# Altium project Pixracer_V1_FMU_Alternative.PrjPcb (part 1 of 2)
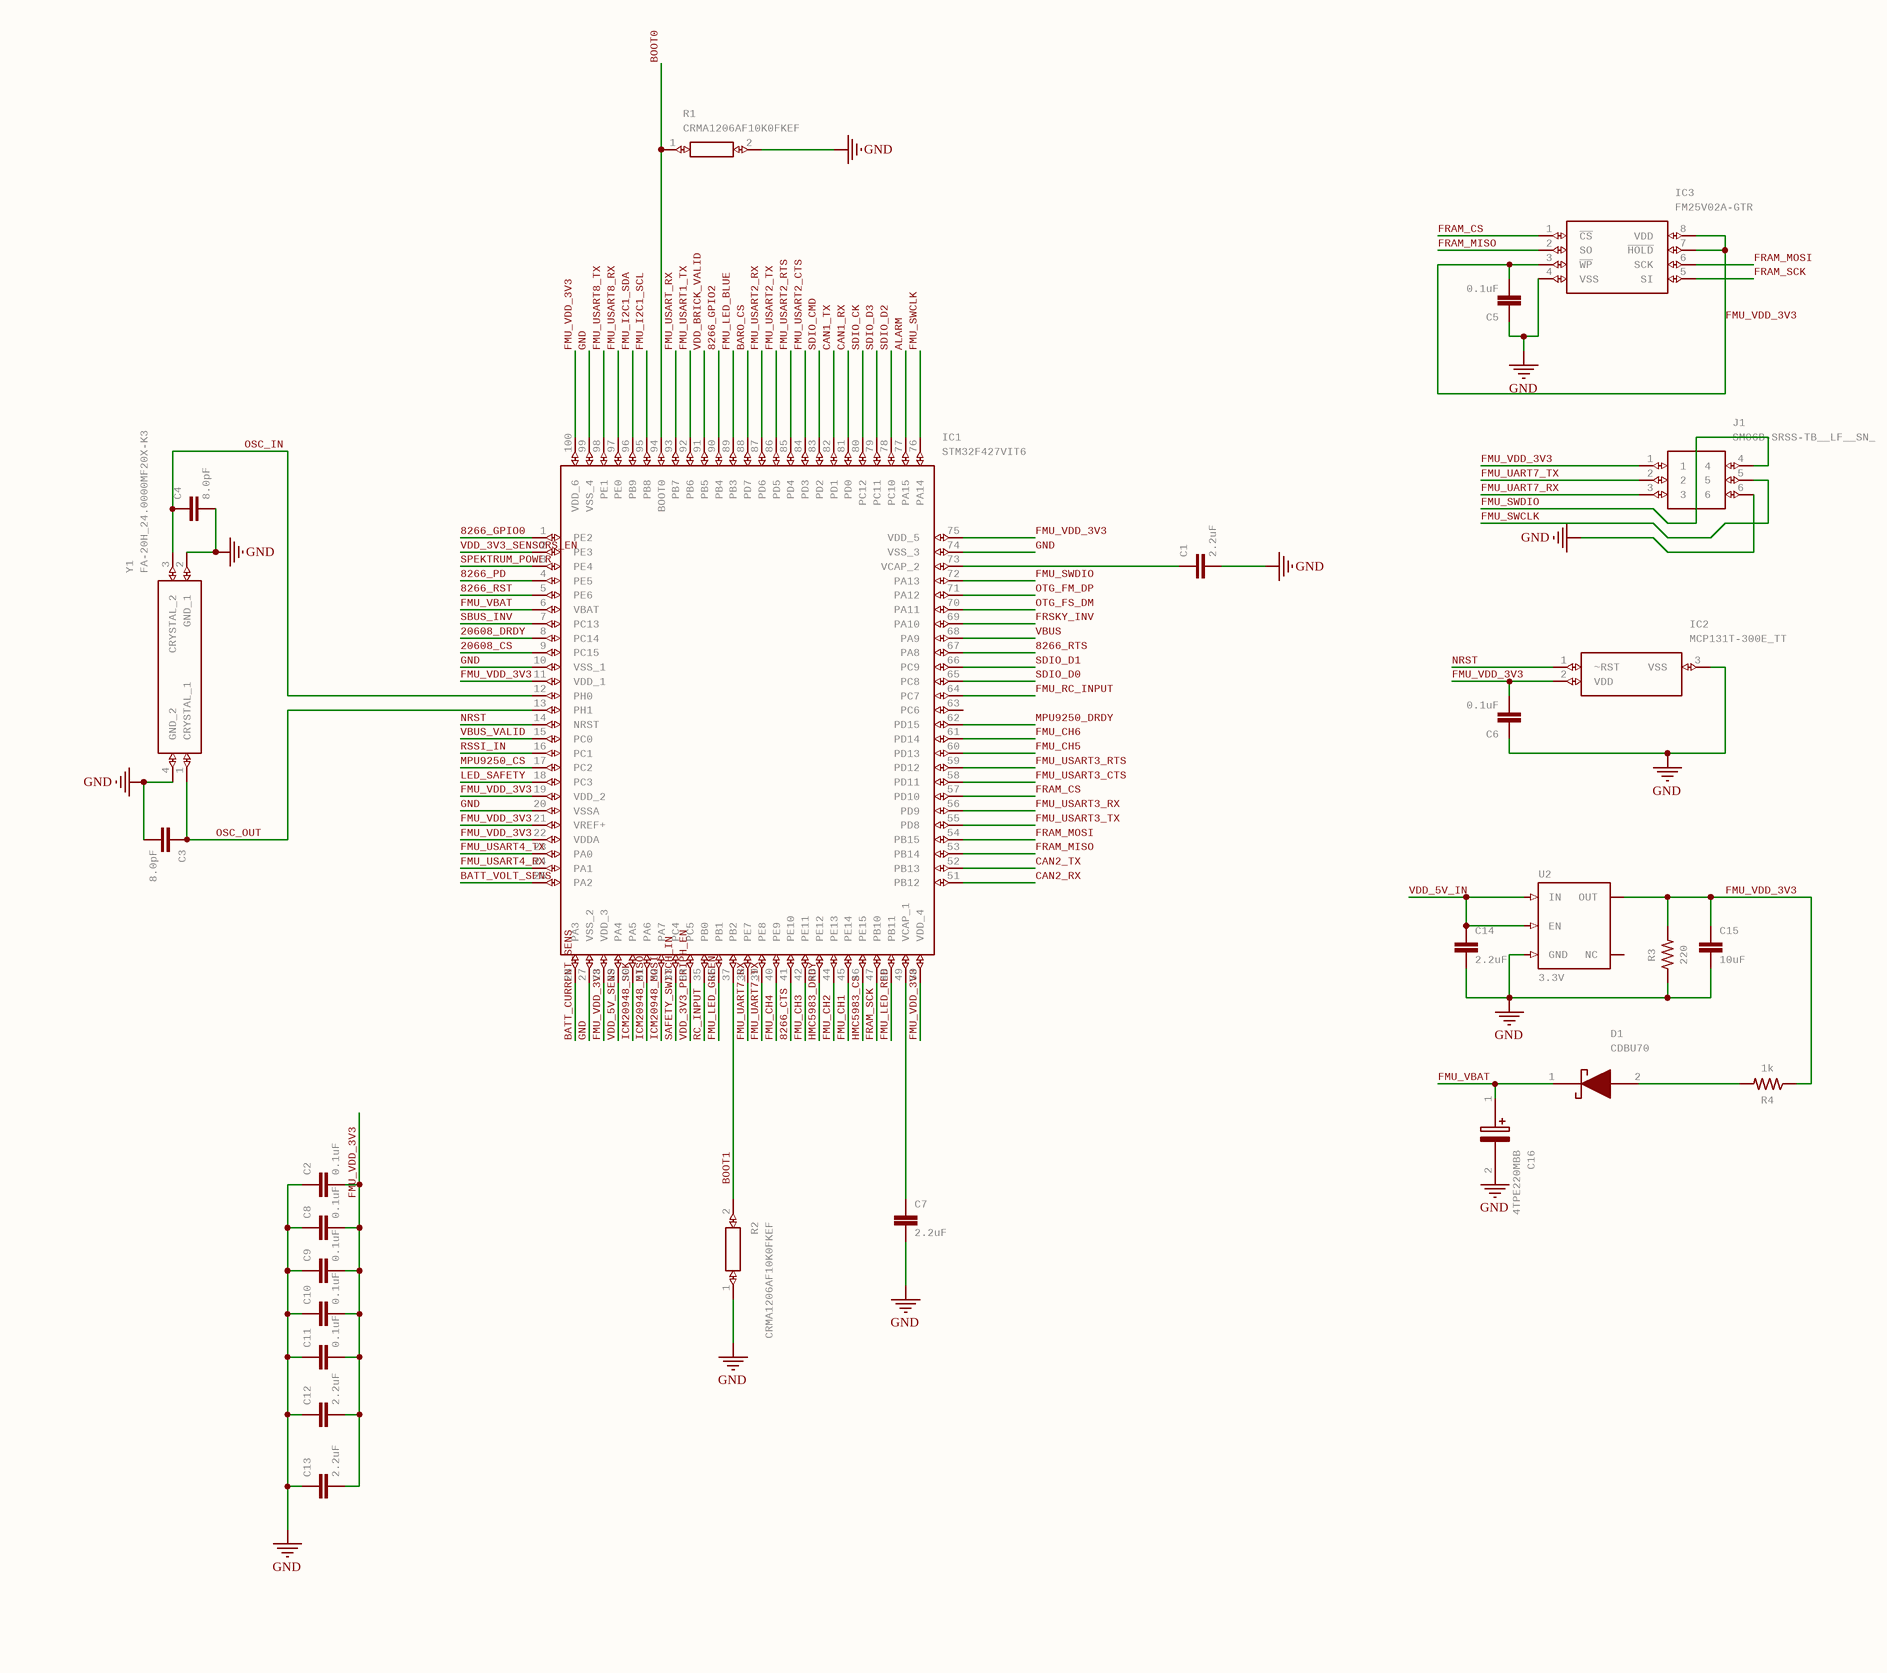
[diagram p0: Pixracer_V1_FMU_Alternative_0.SchDoc]
5 sheets, 139 parts. Net scope: global (net labels, ports and power ports of the same name join across sheets).
Board file: Pixracer_V1_FMU_Alternative.PcbDoc
Sheets:
  Pixracer_V1_FMU_Alternative_0.SchDoc
  Pixracer_V1_FMU_Alternative_1.SchDoc
  Pixracer_V1_FMU_Alternative_2.SchDoc
  Pixracer_V1_FMU_Alternative_3.SchDoc
  Pixracer_V1_FMU_Alternative_4.SchDoc

## Sheet Pixracer_V1_FMU_Alternative_0.SchDoc
size 331 x 293 mm; Origin: Eagle

### Parts
C1  2.2uF  [1206]
C2  0.1uF  [0603]
C3  8.0pF  [0603]
C4  8.0pF  [0603]
C5  0.1uF  [0402]
C6  0.1uF  [0402]
C7  2.2uF  [1206]
C8  0.1uF  [0603]
C9  0.1uF  [0603]
C10  0.1uF  [0603]
C11  0.1uF  [0603]
C12  2.2uF  [1206]
C13  2.2uF  [1206]
C14  2.2uF  [1206]
C15  10uF  [1206]
C16  4TPE220MBB  [4TPE220MBB]
D1  CDBU70  [DIOM179X85N]
IC1  STM32F427VIT6  [QFP50P1600X1600X160-100N]
IC2  MCP131T-300E_TT  [SOT95P237X112-3N]
IC3  FM25V02A-GTR  [SOIC127P602X173-8N]
J1  SM06B-SRSS-TB__LF__SN_  [SM06B-SRSS-TB]
R1  CRMA1206AF10K0FKEF  [RESC3216X74N]
R2  CRMA1206AF10K0FKEF  [RESC3216X74N]
R3  220  [0603]
R4  1k  [0603]
U2  3.3V  [SOT23-5]
Y1  FA-20H_24.0000MF20X-K3  [FA20H160000MF12ZAC3]

### Nets
GND: C1.2 C2.1 C3.2 C4.2 C5.1 C6.1 C7.2 C8.1 C9.1 C10.1 C11.1 C12.1 C13.1 C14.2 C15.2 C16.2(-) IC1.10(VSS_1) IC1.20(VSSA) IC1.27(VSS_2) IC1.74(VSS_3) IC1.99(VSS_4) IC2.3(VSS) IC3.4(VSS) J1.6 R1.2 R2.1 R3.1 U2.2(GND) Y1.2(GND_1) Y1.4(GND_2)
8266_CTS: IC1.41(PE10)
8266_GPIO0: IC1.1(PE2)
8266_GPIO2: IC1.90(PB4)
8266_PD: IC1.4(PE5)
8266_RST: IC1.5(PE6)
8266_RTS: IC1.67(PA8)
20608_CS: IC1.9(PC15)
20608_DRDY: IC1.8(PC14)
ALARM: IC1.77(PA15)
BARO_CS: IC1.88(PD7)
BATT_CURRENT_SENS: IC1.26(PA3)
BATT_VOLT_SENS: IC1.25(PA2)
BOOT0: IC1.94(BOOT0) R1.1
BOOT1: IC1.37(PB2) R2.2
CAN1_RX: IC1.81(PD0)
CAN1_TX: IC1.82(PD1)
CAN2_RX: IC1.51(PB12)
CAN2_TX: IC1.52(PB13)
FMU_CH1: IC1.45(PE14)
FMU_CH2: IC1.44(PE13)
FMU_CH3: IC1.42(PE11)
FMU_CH4: IC1.40(PE9)
FMU_CH5: IC1.60(PD13)
FMU_CH6: IC1.61(PD14)
FMU_I2C1_SCL: IC1.95(PB8)
FMU_I2C1_SDA: IC1.96(PB9)
FMU_LED_BLUE: IC1.89(PB3)
FMU_LED_GREEN: IC1.36(PB1)
FMU_LED_RED: IC1.48(PB11)
FMU_RC_INPUT: IC1.64(PC7)
FMU_SWCLK: IC1.76(PA14) J1.5
FMU_SWDIO: IC1.72(PA13) J1.4
FMU_UART7_RX: IC1.38(PE7) J1.3
FMU_UART7_TX: IC1.39(PE8) J1.2
FMU_USART1_TX: IC1.92(PB6)
FMU_USART2_CTS: IC1.84(PD3)
FMU_USART2_RTS: IC1.85(PD4)
FMU_USART2_RX: IC1.87(PD6)
FMU_USART2_TX: IC1.86(PD5)
FMU_USART3_CTS: IC1.58(PD11)
FMU_USART3_RTS: IC1.59(PD12)
FMU_USART3_RX: IC1.56(PD9)
FMU_USART3_TX: IC1.55(PD8)
FMU_USART4_RX: IC1.24(PA1)
FMU_USART4_TX: IC1.23(PA0)
FMU_USART8_RX: IC1.97(PE0)
FMU_USART8_TX: IC1.98(PE1)
FMU_USART_RX: IC1.93(PB7)
FMU_VBAT: C16.1(+) D1.1(K) IC1.6(VBAT)
FMU_VDD_3V3: C2.2 C5.2 C6.2 C8.2 C9.2 C10.2 C11.2 C12.2 C13.2 C15.1 IC1.11(VDD_1) IC1.19(VDD_2) IC1.21(VREF+) IC1.22(VDDA) IC1.28(VDD_3) IC1.50(VDD_4) IC1.75(VDD_5) IC1.100(VDD_6) IC2.2(VDD) IC3.3(~{WP}) IC3.7(~{HOLD}) IC3.8(VDD) J1.1 R3.2 R4.1 U2.5(OUT)
FRAM_CS: IC1.57(PD10) IC3.1(~{CS})
FRAM_MISO: IC1.53(PB14) IC3.2(SO)
FRAM_MOSI: IC1.54(PB15) IC3.6(SCK)
FRAM_SCK: IC1.47(PB10) IC3.5(SI)
FRSKY_INV: IC1.69(PA10)
HMC5983_CS: IC1.46(PE15)
HMC5983_DRDY: IC1.43(PE12)
ICM20948_MISO: IC1.31(PA6)
ICM20948_MOSI: IC1.32(PA7)
ICM20948_SCK: IC1.30(PA5)
LED_SAFETY: IC1.18(PC3)
MPU9250_CS: IC1.17(PC2)
MPU9250_DRDY: IC1.62(PD15)
NRST: IC1.14(NRST) IC2.1(~RST)
OSC_IN: C4.1 IC1.12(PH0) Y1.3(CRYSTAL_2)
OSC_OUT: C3.1 IC1.13(PH1) Y1.1(CRYSTAL_1)
OTG_FM_DP: IC1.71(PA12)
OTG_FS_DM: IC1.70(PA11)
RC_INPUT: IC1.35(PB0)
RSSI_IN: IC1.16(PC1)
SAFETY_SWITCH_IN: IC1.33(PC4)
SBUS_INV: IC1.7(PC13)
SDIO_CK: IC1.80(PC12)
SDIO_CMD: IC1.83(PD2)
SDIO_D0: IC1.65(PC8)
SDIO_D1: IC1.66(PC9)
SDIO_D2: IC1.78(PC10)
SDIO_D3: IC1.79(PC11)
SPEKTRUM_POWER: IC1.3(PE4)
VBUS: IC1.68(PA9)
VBUS_VALID: IC1.15(PC0)
VDD_3V3_PERIPH_EN: IC1.34(PC5)
VDD_3V3_SENSORS_EN: IC1.2(PE3)
VDD_5V_IN: C14.1 U2.1(IN) U2.3(EN)
VDD_5V_SENS: IC1.29(PA4)
VDD_BRICK_VALID: IC1.91(PB5)
NetC1_1: C1.1 IC1.73(VCAP_2)
NetC7_1: C7.1 IC1.49(VCAP_1)
NetD1_2: D1.2(A) R4.2

Not connected (* = marked no-connect by the designer): IC1 63(PC6); U2 4(NC)

### Library data of the parts
C1 C7 C12-C14 = 2.2UF-1206-50V-10%: 2.2ÂµF ceramic capacitors    A capacitor is a passive two-terminal electrical component used to store electrical energy temporarily in an electric field.; GateName_1: G$1; SymbolName_1: CAP; PROD_ID: CAP-10009; DeviceName: -1206-50V-10%; LibraryName: SparkFun-Capacitors; DeviceSetName: 2.2UF
C2 C8-C11 = 0.1UF-0603-100V-10%-X7R-WE: 0.1ÂµF ceramic capacitors    A capacitor is a passive two-terminal electrical component used to store electrical energy temporarily in an electric field.; GateName_1: G$1; SymbolName_1: CAP; PROD_ID: CAP-16436; DeviceName: -0603-100V-10%-X7R-WE; LibraryName: SparkFun-Capacitors; DeviceSetName: 0.1UF
C3 C4 = 9.0PF-0603-50V-10%: 9.0pF ceramic capacitors    A capacitor is a passive two-terminal electrical component used to store electrical energy temporarily in an electric field.; GateName_1: G$1; SymbolName_1: CAP; PROD_ID: CAP-09341; DeviceName: -0603-50V-10%; LibraryName: SparkFun-Capacitors; DeviceSetName: 9.0PF
C5 C6 = 0.1UF-0402-6.3V-10%-X7R: 0.1ÂµF ceramic capacitors    A capacitor is a passive two-terminal electrical component used to store electrical energy temporarily in an electric field.; GateName_1: G$1; SymbolName_1: CAP; PROD_ID: CAP-14993; DeviceName: -0402-6.3V-10%-X7R; LibraryName: SparkFun-Capacitors; DeviceSetName: 0.1UF
C15 = 10UF-1206-6.3V-20%: 10.0ÂµF ceramic capacitors    A capacitor is a passive two-terminal electrical component used to store electrical energy temporarily in an electric field.; GateName_1: G$1; SymbolName_1: CAP; PROD_ID: CAP-10057; DeviceName: -1206-6.3V-20%; LibraryName: SparkFun-Capacitors; DeviceSetName: 10UF
C16 = 4TPE220MBB: Tantalum Capacitors - Polymer 4VDC 220uF 20% ESR 70mOhm   Source:  Datasheet; MANUFACTURER_NAME: Panasonic; GateName_1: G$1; SymbolName_1: 4TPE220MBB; LibraryName: SamacSys_Parts; DeviceSetName: 4TPE220MBB; HEIGHT: 2mm; MANUFACTURER_PART_NUMBER: 4TPE220MBB; MOUSER_PART_NUMBER: 667-4TPE220MBB; MOUSER_PRICE-STOCK: https://www.mouser.co.uk/ProductDetail/Panasonic/4TPE220MBB?qs=4qgZ1GHix0V27BnmRtQYow%3D%3D
D1 = CDBU70: Schottky Diodes & Rectifiers Schottky Barr Diode 70mA, 70V   Source:  Datasheet; MANUFACTURER_NAME: Comchip Technology; GateName_1: G$1; SymbolName_1: CDBU70; LibraryName: SamacSys_Parts; DeviceSetName: CDBU70; HEIGHT: 0.85mm; MANUFACTURER_PART_NUMBER: CDBU70; MOUSER_PART_NUMBER: 750-CDBU70; MOUSER_PRICE-STOCK: https://www.mouser.co.uk/ProductDetail/Comchip-Technology/CDBU70?qs=J1R1puj4KiHu6WmHr9F3%252Bw%3D%3D
IC1 = STM32F427VIT6: NewSTM32F427VIT6 32bit ARM Cortex M4 MCU, 180MHz, 2048 kB Flash, 256 (System) kB, 4 (Backup) kB RAM, 100-pin LQFP   Source:  Datasheet; MANUFACTURER_NAME: STMicroelectronics; GateName_1: G$1; SymbolName_1: STM32F427VIT6; LibraryName: SamacSys_Parts; DeviceSetName: STM32F427VIT6; HEIGHT: 1.6mm; MANUFACTURER_PART_NUMBER: STM32F427VIT6; MOUSER_PART_NUMBER: 511-STM32F427VIT6; MOUSER_PRICE-STOCK: https://www.mouser.co.uk/ProductDetail/STMicroelectronics/STM32F427VIT6?qs=GlLcxsc1hfFxlQzXIfPRUw%3D%3D
IC2 = MCP131T-300E_TT: Microchip MCP131T-300E/TT, Voltage Supervisor 2.857  3.003 V, 3-Pin SOT-23B   Source:  Datasheet; GateName_1: G$1; SymbolName_1: MCP131T-300E_TT; LibraryName: SamacSys_Parts; DeviceSetName: MCP131T-300E_TT; HEIGHT: mm; MANUFACTURER_NAME: Microchip; MANUFACTURER_PART_NUMBER: MCP131T-300E/TT; MOUSER_PART_NUMBER: 579-MCP131T-300E/TT; MOUSER_PRICE-STOCK: https://www.mouser.com/Search/Refine.aspx?Keyword=579-MCP131T-300E%2FTT
IC3 = FM25V02A-GTR: CYPRESS SEMICONDUCTOR - FM25V02A-GTR - NON-VOL MEMORY, 256KBIT, 40MHZ, SOIC-8   Source:  Datasheet; GateName_1: G$1; SymbolName_1: FM25V02A-GTR; LibraryName: SamacSys_Parts; DeviceSetName: FM25V02A-GTR; HEIGHT: 1.727mm; MANUFACTURER_NAME: Cypress Semiconductor; MANUFACTURER_PART_NUMBER: FM25V02A-GTR; MOUSER_PART_NUMBER: 727-FM25V02A-GTR; MOUSER_PRICE-STOCK: https://www.mouser.co.uk/ProductDetail/Cypress-Semiconductor/FM25V02A-GTR?qs=ILgNtqsyH21Sja70fv%2FiBQ%3D%3D
J1 = SM06B-SRSS-TB__LF__SN_: connector,multipole PCB use,SM06B-SRSS-T JST SH Series, 1mm Pitch 6 Way 1 Row Right Angle PCB Header, Solder Termination, 1A   Source:  Datasheet; MANUFACTURER_NAME: JST (JAPAN SOLDERLESS TERMINALS); MANUFACTURER_PART_NUMBER: SM06B-SRSS-TB (LF)(SN); GateName_1: G$1; SymbolName_1: SM06B-SRSS-TB__LF__SN_; LibraryName: SamacSys_Parts; DeviceSetName: SM06B-SRSS-TB__LF__SN_; HEIGHT: mm; RS_PART_NUMBER: 5468827; RS_PRICE-STOCK: http://uk.rs-online.com/web/p/products/5468827
R1 R2 = CRMA1206AF10K0FKEF: Thick Film Resistors - SMD 0.30W 10Kohm 1% AEC-Q200   Source:  Datasheet; MANUFACTURER_NAME: Vishay; GateName_1: G$1; SymbolName_1: CRMA1206AF10K0FKEF; LibraryName: SamacSys_Parts; DeviceSetName: CRMA1206AF10K0FKEF; HEIGHT: 0.74mm; MANUFACTURER_PART_NUMBER: CRMA1206AF10K0FKEF; MOUSER_PART_NUMBER: 71-CRMA1206AF10K0FKF; MOUSER_PRICE-STOCK: https://www.mouser.co.uk/ProductDetail/Vishay/CRMA1206AF10K0FKEF?qs=TiOZkKH1s2Q81nOs5FD1Wg%3D%3D
R3 = 220OHM-0603-1/10W-1%: 220Î© resistor    A resistor is a passive two-terminal electrical component that implements electrical resistance as a circuit element. Resistors act to reduce current flow, and, at the same time, act to lower voltage levels within circuits. - Wikipedia; GateName_1: G$1; DeviceSetName: 220OHM; PROD_ID: RES-07861; SymbolName_1: RESISTOR; DeviceName: -0603-1/10W-1%; LibraryName: SparkFun-Resistors
R4 = 1KOHM-0603-1/10W-1%: 1kÎ© resistor    A resistor is a passive two-terminal electrical component that implements electrical resistance as a circuit element. Resistors act to reduce current flow, and, at the same time, act to lower voltage levels within circuits. - Wikipedia; GateName_1: G$1; DeviceSetName: 1KOHM; PROD_ID: RES-07856; SymbolName_1: RESISTOR; DeviceName: -0603-1/10W-1%; LibraryName: SparkFun-Resistors
U2 = V_REG_LP5907SOT23-3.0V: LP5907 - 250mA Ultra-Low-Noise LDO Regulator w/ Enable    The LP5907 is a low-noise LDO that can supply up to 250 mA output current. Designed to meet the requirements of RF and analog circuits, the LP5907 device provides low noise, high PSRR, low quiescent current, and low line or load transient response figures. Using new innovative design techniques, the LP5907 offers class-leading noise performance without a noise bypass capacitor and the ability for remote output capacitor placement. The device is designed to work with a 1-ÂµF input and a 1-ÂµF output ceramic capacitor (no separate noise bypass capacitor is required). This device is available with fixed output voltages from 1.2 V to 4.5 V in 25-mV steps.; MANU_PART: LP5907MFX-3.0/NOPB; GateName_1: G$1; SymbolName_1: V-REG-LDO_NO-BP; PROD_ID: VREG-15586; DeviceName: SOT23-3.0V; LibraryName: SparkFun-IC-Power; DeviceSetName: V_REG_LP5907; DIGIKEY_PART: 296-40357-1-ND; MOUSER_PART: 595-LP5907MFX-3.0NPB; PACKAGE: SOT-23(5)
Y1 = FA-20H_24.0000MF20X-K3: Source:  Datasheet; MANUFACTURER_NAME: Epson Timing; MANUFACTURER_PART_NUMBER: FA-20H 24.0000MF20X-K3; GateName_1: G$1; SymbolName_1: FA-20H_24.0000MF20X-K3; LibraryName: SamacSys_Parts; DeviceSetName: FA-20H_24.0000MF20X-K3; HEIGHT: 0.55mm; MOUSER_PART_NUMBER: 732-FA20H-24F20X-K3; MOUSER_PRICE-STOCK: https://www.mouser.co.uk/ProductDetail/Epson-Timing/FA-20H-240000MF20X-K3?qs=CANAagUtPAp2w31393daZQ%3D%3D

## Sheet Pixracer_V1_FMU_Alternative_1.SchDoc
size 431 x 179 mm; Origin: Eagle
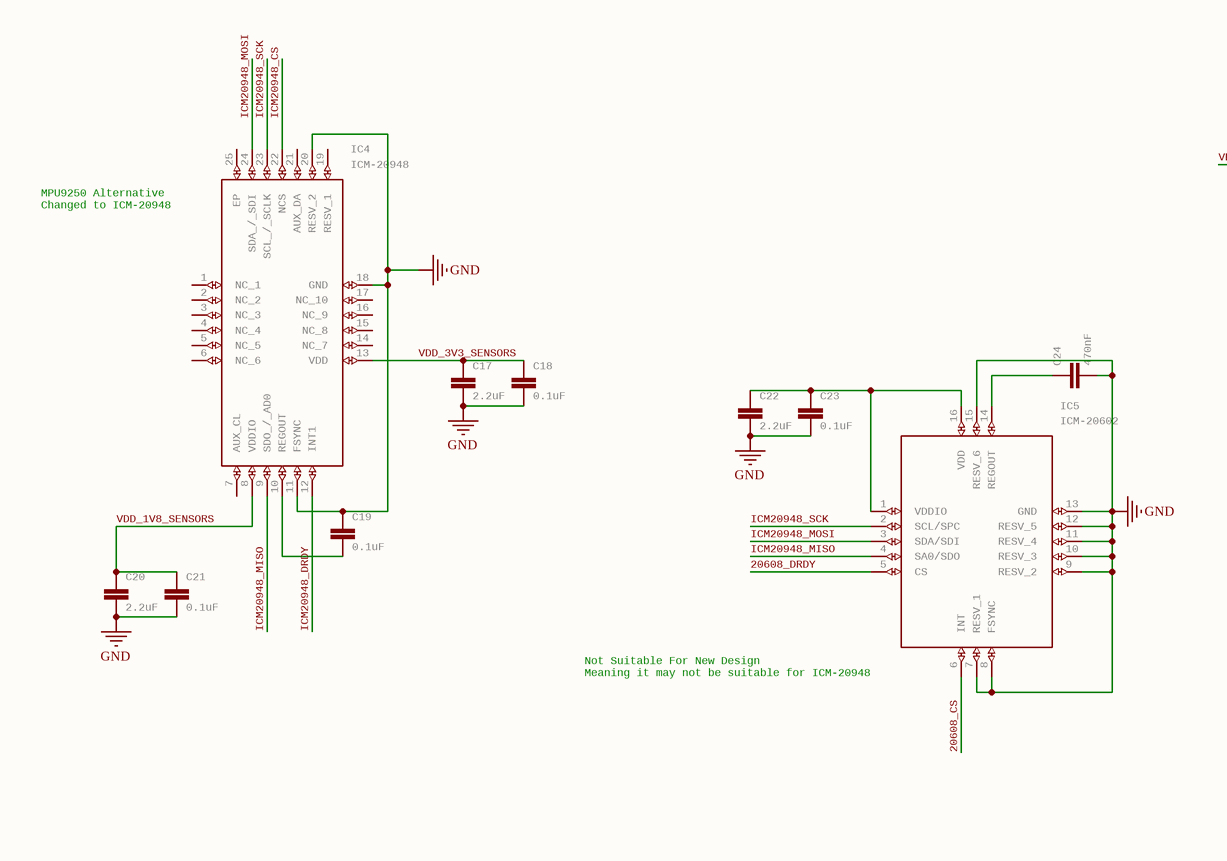
[diagram p1: Pixracer_V1_FMU_Alternative_1.SchDoc, left]
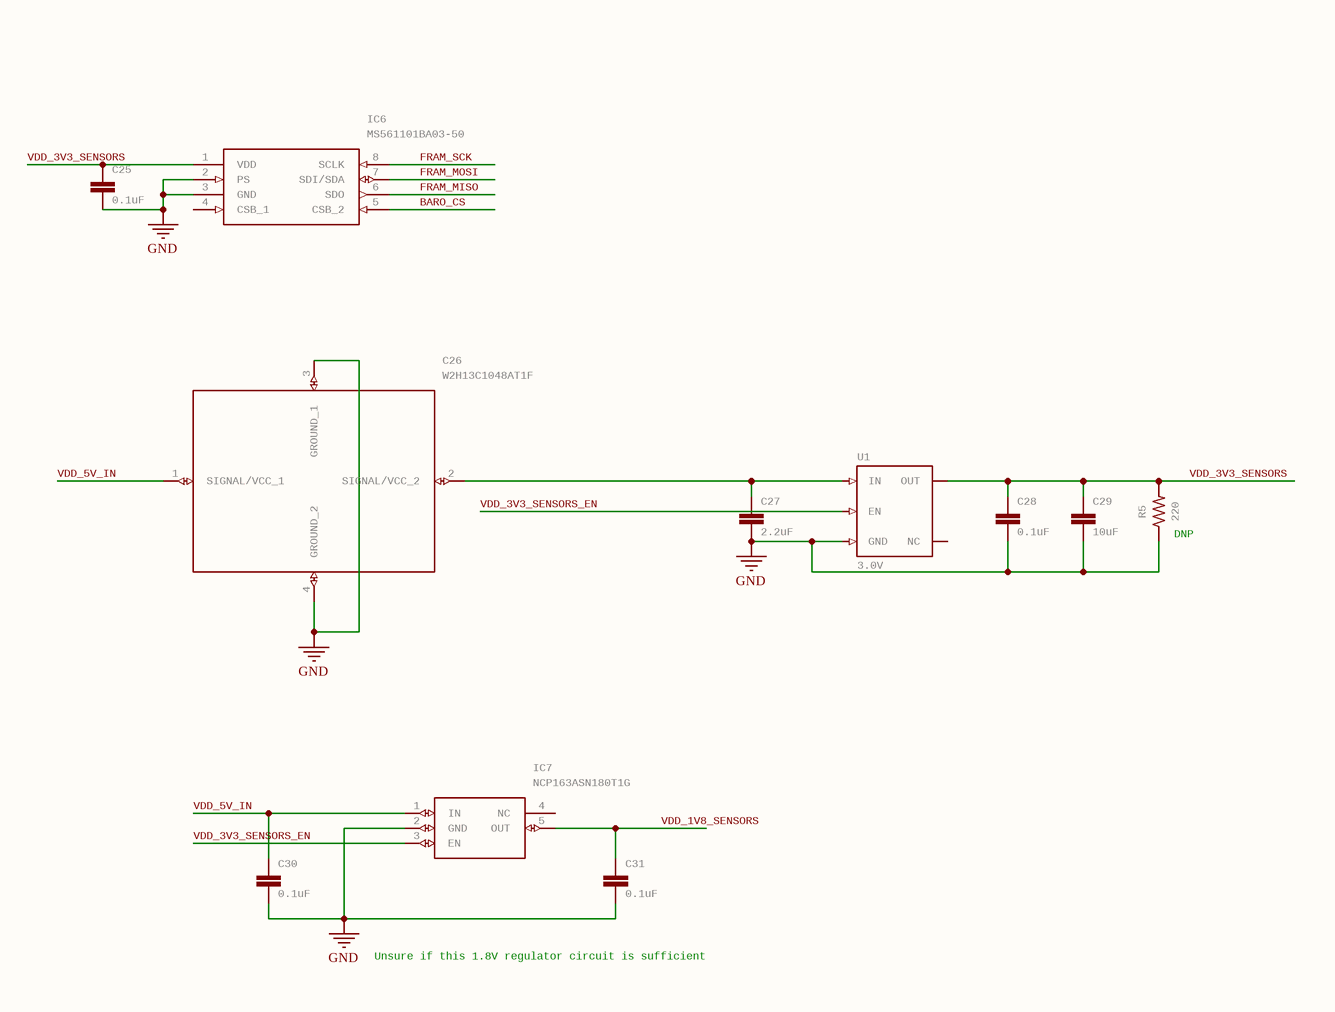
[diagram p2: Pixracer_V1_FMU_Alternative_1.SchDoc, right]

### Parts
C17  2.2uF  [1206]
C18  0.1uF  [0603]
C19  0.1uF  [0603]
C20  2.2uF  [1206]
C21  0.1uF  [0603]
C22  2.2uF  [1206]
C23  0.1uF  [0603]
C24  470nF  [0603]
C25  0.1uF  [0603]
C26  W2H13C1048AT1F  [W2H13C1048AT1A]
C27  2.2uF  [1206]
C28  0.1uF  [0603]
C29  10uF  [1206]
C30  0.1uF  [0603]
C31  0.1uF  [0603]
IC4  ICM-20948  [QFN40P300X300X105-25N]
IC5  ICM-20602  [IAM20680HP]
IC6  MS561101BA03-50  [MS561101BA03-50]
IC7  NCP163ASN180T1G  [SOT95P280X145-5N]
R5  220  [0603]
U1  3.0V  [SOT23-5]

### Nets
GND: C17.2 C18.2 C19.1 C20.2 C21.2 C22.2 C23.2 C24.2 C25.2 C26.3(GROUND_1) C26.4(GROUND_2) C27.2 C28.2 C29.2 C30.2 C31.2 IC4.11(FSYNC) IC4.18(GND) IC4.20(RESV_2) IC5.7(RESV_1) IC5.8(FSYNC) IC5.9(RESV_2) IC5.10(RESV_3) IC5.11(RESV_4) IC5.12(RESV_5) IC5.13(GND) IC5.15(RESV_6) IC6.2(PS) IC6.3(GND) IC7.2(GND) R5.1 U1.2(GND)
20608_CS: IC5.6(INT)
20608_DRDY: IC5.5(CS)
BARO_CS: IC6.5(CSB_2)
FRAM_MISO: IC6.6(SDO)
FRAM_MOSI: IC6.7(SDI/SDA)
FRAM_SCK: IC6.8(SCLK)
ICM20948_CS: IC4.22(NCS)
ICM20948_DRDY: IC4.12(INT1)
ICM20948_MISO: IC4.9(SDO_/_AD0) IC5.4(SA0/SDO)
ICM20948_MOSI: IC4.24(SDA_/_SDI) IC5.3(SDA/SDI)
ICM20948_SCK: IC4.23(SCL_/_SCLK) IC5.2(SCL/SPC)
VDD_1V8_SENSORS: C20.1 C21.1 C31.1 IC4.8(VDDIO) IC7.5(OUT)
VDD_3V3_SENSORS: C17.1 C18.1 C25.1 C28.1 C29.1 IC4.13(VDD) IC6.1(VDD) R5.2 U1.5(OUT)
VDD_3V3_SENSORS_EN: IC7.3(EN) U1.3(EN)
VDD_5V_IN: C26.1(SIGNAL/VCC_1) C30.1 IC7.1(IN)
NetC19_2: C19.2 IC4.10(REGOUT)
NetC22_1: C22.1 C23.1 IC5.1(VDDIO) IC5.16(VDD)
NetC24_1: C24.1 IC5.14(REGOUT)
NetC26_2: C26.2(SIGNAL/VCC_2) C27.1 U1.1(IN)

Not connected (* = marked no-connect by the designer): IC4 1(NC_1) 2(NC_2) 3(NC_3) 4(NC_4) 5(NC_5) 6(NC_6) 7(AUX_CL) 14(NC_7) 15(NC_8) 16(NC_9) 17(NC_10) 19(RESV_1) 21(AUX_DA) 25(EP); IC6 4(CSB_1); IC7 4(NC); U1 4(NC)

### Notes on the sheet
- (near IC4) MPU9250 Alternative
  Changed to ICM-20948
- (near R5) DNP
- (near IC5) Not Suitable For New Design
  Meaning it may not be suitable for ICM-20948
- Unsure if this 1.8V regulator circuit is sufficient

### Library data of the parts
C17 C20 C22 C27 = 2.2UF-1206-50V-10%: as C1 on sheet Pixracer_V1_FMU_Alternative_0; DeviceName: -1206-50V-10%; LibraryName: SparkFun-Capacitors; DeviceSetName: 2.2UF
C18 C19 C21 C23 C25 C28 C30 C31 = 0.1UF-0603-100V-10%-X7R-WE: as C2 on sheet Pixracer_V1_FMU_Alternative_0; DeviceName: -0603-100V-10%-X7R-WE; LibraryName: SparkFun-Capacitors; DeviceSetName: 0.1UF
C24 = 470NF-0603-10V-10%-X5R: 0.47uF/470nF ceramic capacitors    A capacitor is a passive two-terminal electrical component used to store electrical energy temporarily in an electric field.; GateName_1: G$1; SymbolName_1: CAP; PROD_ID: CAP-13216; DeviceName: -0603-10V-10%-X5R; LibraryName: SparkFun-Capacitors; DeviceSetName: 470NF
C26 = W2H13C1048AT1F: Feed Through Capacitors 25volt 0.1uF X7R   Source:  Datasheet; MANUFACTURER_NAME: AVX; GateName_1: G$1; SymbolName_1: W2H13C1048AT1F; LibraryName: SamacSys_Parts; DeviceSetName: W2H13C1048AT1F; DESCRIPTION: Feed Through Capacitors 25volt 0.1uF X7R; HEIGHT: 1mm; MANUFACTURER_PART_NUMBER: W2H13C1048AT1F; MOUSER_PART_NUMBER: 581-W2H13C1048AT1F; MOUSER_PRICE-STOCK: https://www.mouser.com/Search/Refine.aspx?Keyword=581-W2H13C1048AT1F
C29 = 10UF-1206-6.3V-20%: as C15 on sheet Pixracer_V1_FMU_Alternative_0; DeviceName: -1206-6.3V-20%; LibraryName: SparkFun-Capacitors; DeviceSetName: 10UF
IC4 = ICM-20948: IMUs - Inertial Measurement Units World's Lowest Power 9-Axis MEMS MotionTracking Device   Source:  Datasheet; MANUFACTURER_NAME: TDK; GateName_1: G$1; SymbolName_1: ICM-20948; LibraryName: SamacSys_Parts; DeviceSetName: ICM-20948; DESCRIPTION: IMUs - Inertial Measurement Units World's Lowest Power 9-Axis MEMS MotionTracking Device; HEIGHT: 1.05mm; MANUFACTURER_PART_NUMBER: ICM-20948; MOUSER_PART_NUMBER: 410-ICM-20948; MOUSER_PRICE-STOCK: https://www.mouser.co.uk/ProductDetail/TDK-InvenSense/ICM-20948?qs=u4fy%2FsgLU9OtGc31yF%2Friw%3D%3D
IC5 = ICM-20602: IMUs - Inertial Measurement Units Low-Power, High-Performance Integrated 6-Axis MEMS MotionTracking  Device in 3mm x 3mm Package   Source:  Datasheet; MANUFACTURER_NAME: TDK; GateName_1: G$1; SymbolName_1: ICM-20602; LibraryName: SamacSys_Parts; DeviceSetName: ICM-20602; DESCRIPTION: IMUs - Inertial Measurement Units Low-Power, High-Performance Integrated 6-Axis MEMS MotionTracking  Device in 3mm x 3mm Package; HEIGHT: mm; MANUFACTURER_PART_NUMBER: ICM-20602; MOUSER_PART_NUMBER: 410-ICM-20602; MOUSER_PRICE-STOCK: https://www.mouser.co.uk/ProductDetail/TDK-InvenSense/ICM-20602?qs=u4fy%2FsgLU9NtDChFbqTxBA%3D%3D
IC6 = MS561101BA03-50: Sensor Pressure 1.2bar Barometric SMD MS561101BA03-50, Barometric Pressure Sensor, 1200mbar 0  3.6 V Output, 8-Pin QFN   Source:  Datasheet; MANUFACTURER_NAME: TE Connectivity; GateName_1: G$1; SymbolName_1: MS561101BA03-50; LibraryName: SamacSys_Parts; DeviceSetName: MS561101BA03-50; DESCRIPTION: Sensor Pressure 1.2bar Barometric SMD MS561101BA03-50, Barometric Pressure Sensor, 1200mbar 0  3.6 V Output, 8-Pin QFN; HEIGHT: mm; MANUFACTURER_PART_NUMBER: MS561101BA03-50; MOUSER_PART_NUMBER: 824-MS561101BA03-50; MOUSER_PRICE-STOCK: https://www.mouser.co.uk/ProductDetail/Measurement-Specialties/MS561101BA03-50?qs=%252BgKeJhng5iV%252BnCz6Qd5iDw%3D%3D
IC7 = NCP163ASN180T1G: LDO Voltage Regulators LDO Reg, Ultra-Low Noise High PSRR 1.8V   Source:  Datasheet; MANUFACTURER_NAME: onsemi; GateName_1: G$1; SymbolName_1: NCP163ASN180T1G; LibraryName: SamacSys_Parts; DeviceSetName: NCP163ASN180T1G; DESCRIPTION: LDO Voltage Regulators LDO Reg, Ultra-Low Noise High PSRR 1.8V; HEIGHT: 1.45mm; MANUFACTURER_PART_NUMBER: NCP163ASN180T1G; MOUSER_PART_NUMBER: 863-NCP163ASN180T1G; MOUSER_PRICE-STOCK: https://www.mouser.co.uk/ProductDetail/onsemi/NCP163ASN180T1G?qs=vLWxofP3U2z0o2tJM%252BNAYw%3D%3D
R5 = 220OHM-0603-1/10W-1%: as R3 on sheet Pixracer_V1_FMU_Alternative_0; SymbolName_1: RESISTOR; DeviceName: -0603-1/10W-1%; LibraryName: SparkFun-Resistors
U1 = V_REG_LP5907SOT23-3.0V: as U2 on sheet Pixracer_V1_FMU_Alternative_0; DeviceName: SOT23-3.0V; LibraryName: SparkFun-IC-Power; DeviceSetName: V_REG_LP5907; DIGIKEY_PART: 296-40357-1-ND; MOUSER_PART: 595-LP5907MFX-3.0NPB; PACKAGE: SOT-23(5)

## Sheet Pixracer_V1_FMU_Alternative_2.SchDoc
size 287 x 183 mm; Origin: Eagle
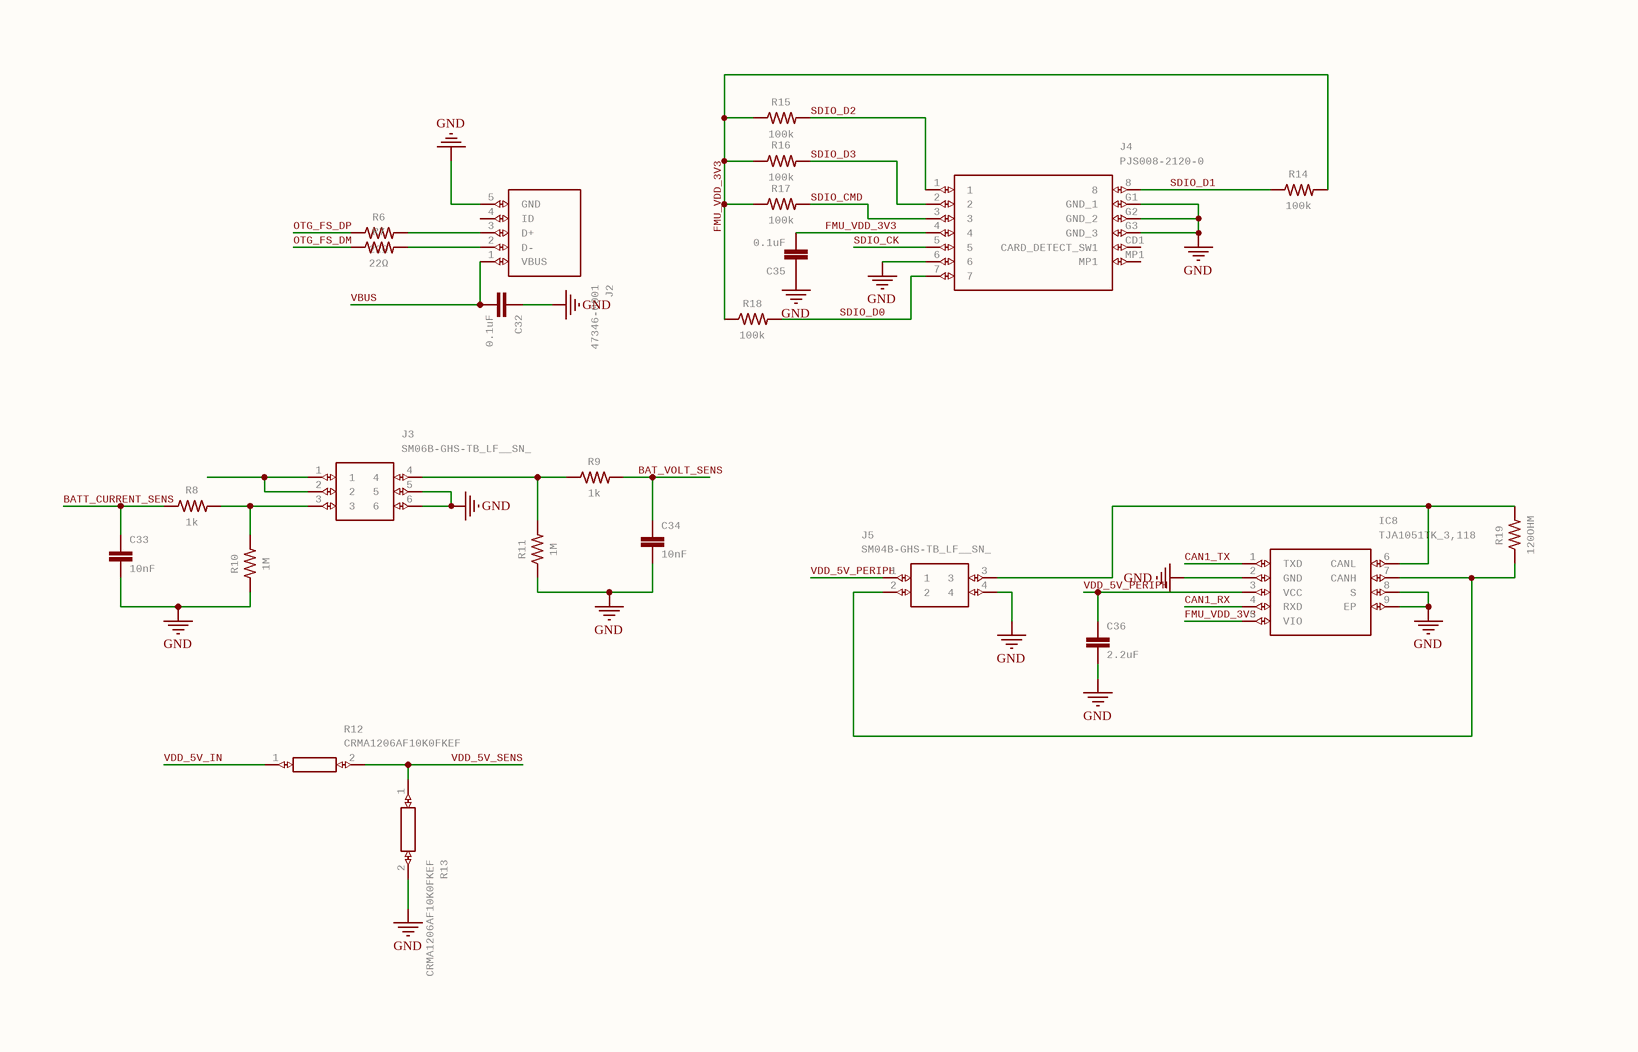
[diagram p3: Pixracer_V1_FMU_Alternative_2.SchDoc]

### Parts
C32  0.1uF  [0603]
C33  10nF  [0603]
C34  10nF  [0603]
C35  0.1uF  [0603]
C36  2.2uF  [1206]
IC8  TJA1051TK_3,118  [SON65P300X300X100-9N]
J2  47346-0001  [47346-0001]
J3  SM06B-GHS-TB_LF__SN_  [SM06B-GHS-TB]
J4  PJS008-2120-0  [PJS00821200]
J5  SM04B-GHS-TB_LF__SN_  [SM04B-GHS-TB]
R6  22Ω  [0603]
R7  22Ω  [0603]
R8  1k  [0603]
R9  1k  [0603]
R10  1M  [0603]
R11  1M  [0603]
R12  CRMA1206AF10K0FKEF  [RESC3216X74N]
R13  CRMA1206AF10K0FKEF  [RESC3216X74N]
R14  100k  [0603]
R15  100k  [0603]
R16  100k  [0603]
R17  100k  [0603]
R18  100k  [0603]
R19  120OHM  [0603]

### Nets
GND: C32.1 C33.2 C34.2 C35.1 C36.2 IC8.2(GND) IC8.8(S) IC8.9(EP) J2.5(GND) J3.5 J3.6 J4.6 J4.G1(GND_1) J4.G2(GND_2) J4.G3(GND_3) J5.4 R10.1 R11.1 R13.2
BAT_VOLT_SENS: C34.1 R9.2
BATT_CURRENT_SENS: C33.1 R8.1
CAN1_RX: IC8.4(RXD)
CAN1_TX: IC8.1(TXD)
FMU_VDD_3V3: C35.2 IC8.5(VIO) J4.4 R14.2 R15.1 R16.1 R17.1 R18.1
OTG_FS_DM: R7.1
OTG_FS_DP: R6.1
SDIO_CK: J4.5
SDIO_CMD: J4.3 R17.2
SDIO_D0: J4.7 R18.2
SDIO_D1: J4.8 R14.1
SDIO_D2: J4.1 R15.2
SDIO_D3: J4.2 R16.2
VBUS: C32.2 J2.1(VBUS)
VDD_5V_IN: R12.1
VDD_5V_PERIPH: C36.1 IC8.3(VCC) J5.1
VDD_5V_SENS: R12.2 R13.1
NetIC8_6: IC8.6(CANL) J5.3 R19.2
NetIC8_7: IC8.7(CANH) J5.2 R19.1
NetJ2_2: J2.2(D-) R7.2
NetJ2_3: J2.3(D+) R6.2
NetJ3_1: J3.1 J3.2
NetJ3_3: J3.3 R8.2 R10.2
NetJ3_4: J3.4 R9.1 R11.2

Not connected (* = marked no-connect by the designer): J2 4(ID); J4 CD1(CARD_DETECT_SW1) MP1

### Library data of the parts
C32 C35 = 0.1UF-0603-100V-10%-X7R-WE: as C2 on sheet Pixracer_V1_FMU_Alternative_0; DeviceName: -0603-100V-10%-X7R-WE; LibraryName: SparkFun-Capacitors; DeviceSetName: 0.1UF
C33 C34 = 10NF-0603-50V-10%: 0.01uF/10nF/10,000pF ceramic capacitors    A capacitor is a passive two-terminal electrical component used to store electrical energy temporarily in an electric field.CAP-09321; GateName_1: G$1; SymbolName_1: CAP; PROD_ID: CAP-00867; DeviceName: -0603-50V-10%; LibraryName: SparkFun-Capacitors; DeviceSetName: 10NF
C36 = 2.2UF-1206-50V-10%: as C1 on sheet Pixracer_V1_FMU_Alternative_0; DeviceName: -1206-50V-10%; LibraryName: SparkFun-Capacitors; DeviceSetName: 2.2UF
IC8 = TJA1051TK_3,118: High-speed CAN transceiver   Source:  Datasheet; MANUFACTURER_NAME: NXP; MANUFACTURER_PART_NUMBER: TJA1051TK/3,118; GateName_1: G$1; SymbolName_1: TJA1051TK_3,118; LibraryName: SamacSys_Parts; DeviceSetName: TJA1051TK_3,118; DESCRIPTION: High-speed CAN transceiver; HEIGHT: 1mm; MOUSER_PART_NUMBER: 771-TJA1051TK/3118; MOUSER_PRICE-STOCK: https://www.mouser.co.uk/ProductDetail/NXP-Semiconductors/TJA1051TK-3118?qs=fhAOlxDPaYVrDQ2e4g%252BBJA%3D%3D
J2 = 47346-0001: Micro USB B Receptacle Bottom Mount Assy Molex Right Angle SMT Type B Version 2.0 Micro USB Connector Socket, 30 V ac, 1A 47352 MICRO-USB   Source:  Datasheet; GateName_1: G$1; SymbolName_1: 47346-0001; LibraryName: SamacSys_Parts; DeviceSetName: 47346-0001; DESCRIPTION: Micro USB B Receptacle Bottom Mount Assy Molex Right Angle SMT Type B Version 2.0 Micro USB Connector Socket, 30 V ac, 1A 47352 MICRO-USB; HEIGHT: mm; MANUFACTURER_NAME: Molex; MANUFACTURER_PART_NUMBER: 47346-0001; MOUSER_PART_NUMBER: 538-47346-0001; MOUSER_PRICE-STOCK: https://www.mouser.co.uk/ProductDetail/Molex/47346-0001?qs=c2CV6XM0DweJBWaSeyWeCw%3D%3D
J3 = SM06B-GHS-TB_LF__SN_: GH 1.25mm header side entry 6 way JST GH Series, 1.25mm Pitch 6 Way Right Angle PCB Header, Solder Termination, 1A   Source:  Datasheet; MANUFACTURER_NAME: JST (JAPAN SOLDERLESS TERMINALS); MANUFACTURER_PART_NUMBER: SM06B-GHS-TB(LF)(SN); GateName_1: G$1; SymbolName_1: SM06B-GHS-TB_LF__SN_; LibraryName: SamacSys_Parts; DeviceSetName: SM06B-GHS-TB_LF__SN_; DESCRIPTION: GH 1.25mm header side entry 6 way JST GH Series, 1.25mm Pitch 6 Way Right Angle PCB Header, Solder Termination, 1A; HEIGHT: mm; RS_PART_NUMBER: 7521800P; RS_PRICE-STOCK: http://uk.rs-online.com/web/p/products/7521800P
J4 = PJS008-2120-0: Memory Card Connectors STD MNT MICRO SD PUSH-PUSH, SMT CONN   Source:  Datasheet; MANUFACTURER_NAME: Yamaichi; GateName_1: G$1; SymbolName_1: PJS008-2120-0; LibraryName: SamacSys_Parts; DeviceSetName: PJS008-2120-0; DESCRIPTION: Memory Card Connectors STD MNT MICRO SD PUSH-PUSH, SMT CONN; HEIGHT: 1.5mm; MANUFACTURER_PART_NUMBER: PJS008-2120-0; MOUSER_PART_NUMBER: 945-PJS008-2120-0; MOUSER_PRICE-STOCK: https://www.mouser.co.uk/ProductDetail/Yamaichi-Electronics/PJS008-2120-0?qs=pDnM3xHIg41mTHT1wk7bvQ%3D%3D
J5 = SM04B-GHS-TB_LF__SN_: JST GH Series, 1.25mm Pitch 4 Way Right Angle PCB Header, Solder Termination, 1A   Source:  Datasheet; MANUFACTURER_NAME: JST (JAPAN SOLDERLESS TERMINALS); MANUFACTURER_PART_NUMBER: SM04B-GHS-TB(LF)(SN); GateName_1: G$1; SymbolName_1: SM04B-GHS-TB_LF__SN_; LibraryName: SamacSys_Parts; DeviceSetName: SM04B-GHS-TB_LF__SN_; DESCRIPTION: JST GH Series, 1.25mm Pitch 4 Way Right Angle PCB Header, Solder Termination, 1A; HEIGHT: mm; RS_PART_NUMBER: 7521797P; RS_PRICE-STOCK: http://uk.rs-online.com/web/p/products/7521797P
R6 R7 = 22OHM-0603-1/10W-1%: 22Î© resistor    A resistor is a passive two-terminal electrical component that implements electrical resistance as a circuit element. Resistors act to reduce current flow, and, at the same time, act to lower voltage levels within circuits. - Wikipedia; GateName_1: G$1; DeviceSetName: 22OHM; PROD_ID: RES-08698; SymbolName_1: RESISTOR; DeviceName: -0603-1/10W-1%; LibraryName: SparkFun-Resistors
R8 R9 = 1KOHM-0603-1/10W-1%: as R4 on sheet Pixracer_V1_FMU_Alternative_0; SymbolName_1: RESISTOR; DeviceName: -0603-1/10W-1%; LibraryName: SparkFun-Resistors
R10 R11 = 1MOHM-0603-1/4W-5%: 1MÎ© resistor    A resistor is a passive two-terminal electrical component that implements electrical resistance as a circuit element. Resistors act to reduce current flow, and, at the same time, act to lower voltage levels within circuits. - Wikipedia; GateName_1: G$1; DeviceSetName: 1MOHM; PROD_ID: RES-07868; SymbolName_1: RESISTOR; DeviceName: -0603-1/4W-5%; LibraryName: SparkFun-Resistors
R12 R13 = CRMA1206AF10K0FKEF: as R1 on sheet Pixracer_V1_FMU_Alternative_0; SymbolName_1: CRMA1206AF10K0FKEF; LibraryName: SamacSys_Parts; DeviceSetName: CRMA1206AF10K0FKEF; DESCRIPTION: Thick Film Resistors - SMD 0.30W 10Kohm 1% AEC-Q200; HEIGHT: 0.74mm; MANUFACTURER_PART_NUMBER: CRMA1206AF10K0FKEF; MOUSER_PART_NUMBER: 71-CRMA1206AF10K0FKF; MOUSER_PRICE-STOCK: https://www.mouser.co.uk/ProductDetail/Vishay/CRMA1206AF10K0FKEF?qs=TiOZkKH1s2Q81nOs5FD1Wg%3D%3D
R14-R18 = 100KOHM-0603-1/10W-1%: 100kÎ© resistor    A resistor is a passive two-terminal electrical component that implements electrical resistance as a circuit element. Resistors act to reduce current flow, and, at the same time, act to lower voltage levels within circuits. - Wikipedia; GateName_1: G$1; PROD_ID: RES-07828; SymbolName_1: RESISTOR; DeviceName: -0603-1/10W-1%; LibraryName: SparkFun-Resistors; DeviceSetName: 100KOHM
R19 = 120OHM: 120Î© resistor    A resistor is a passive two-terminal electrical component that implements electrical resistance as a circuit element. Resistors act to reduce current flow, and, at the same time, act to lower voltage levels within circuits. - Wikipedia; GateName_1: G$1; SymbolName_1: RESISTOR; LibraryName: SparkFun-Resistors; DeviceSetName: 120OHM

## Sheet Pixracer_V1_FMU_Alternative_3.SchDoc
size 371 x 257 mm; Origin: Eagle
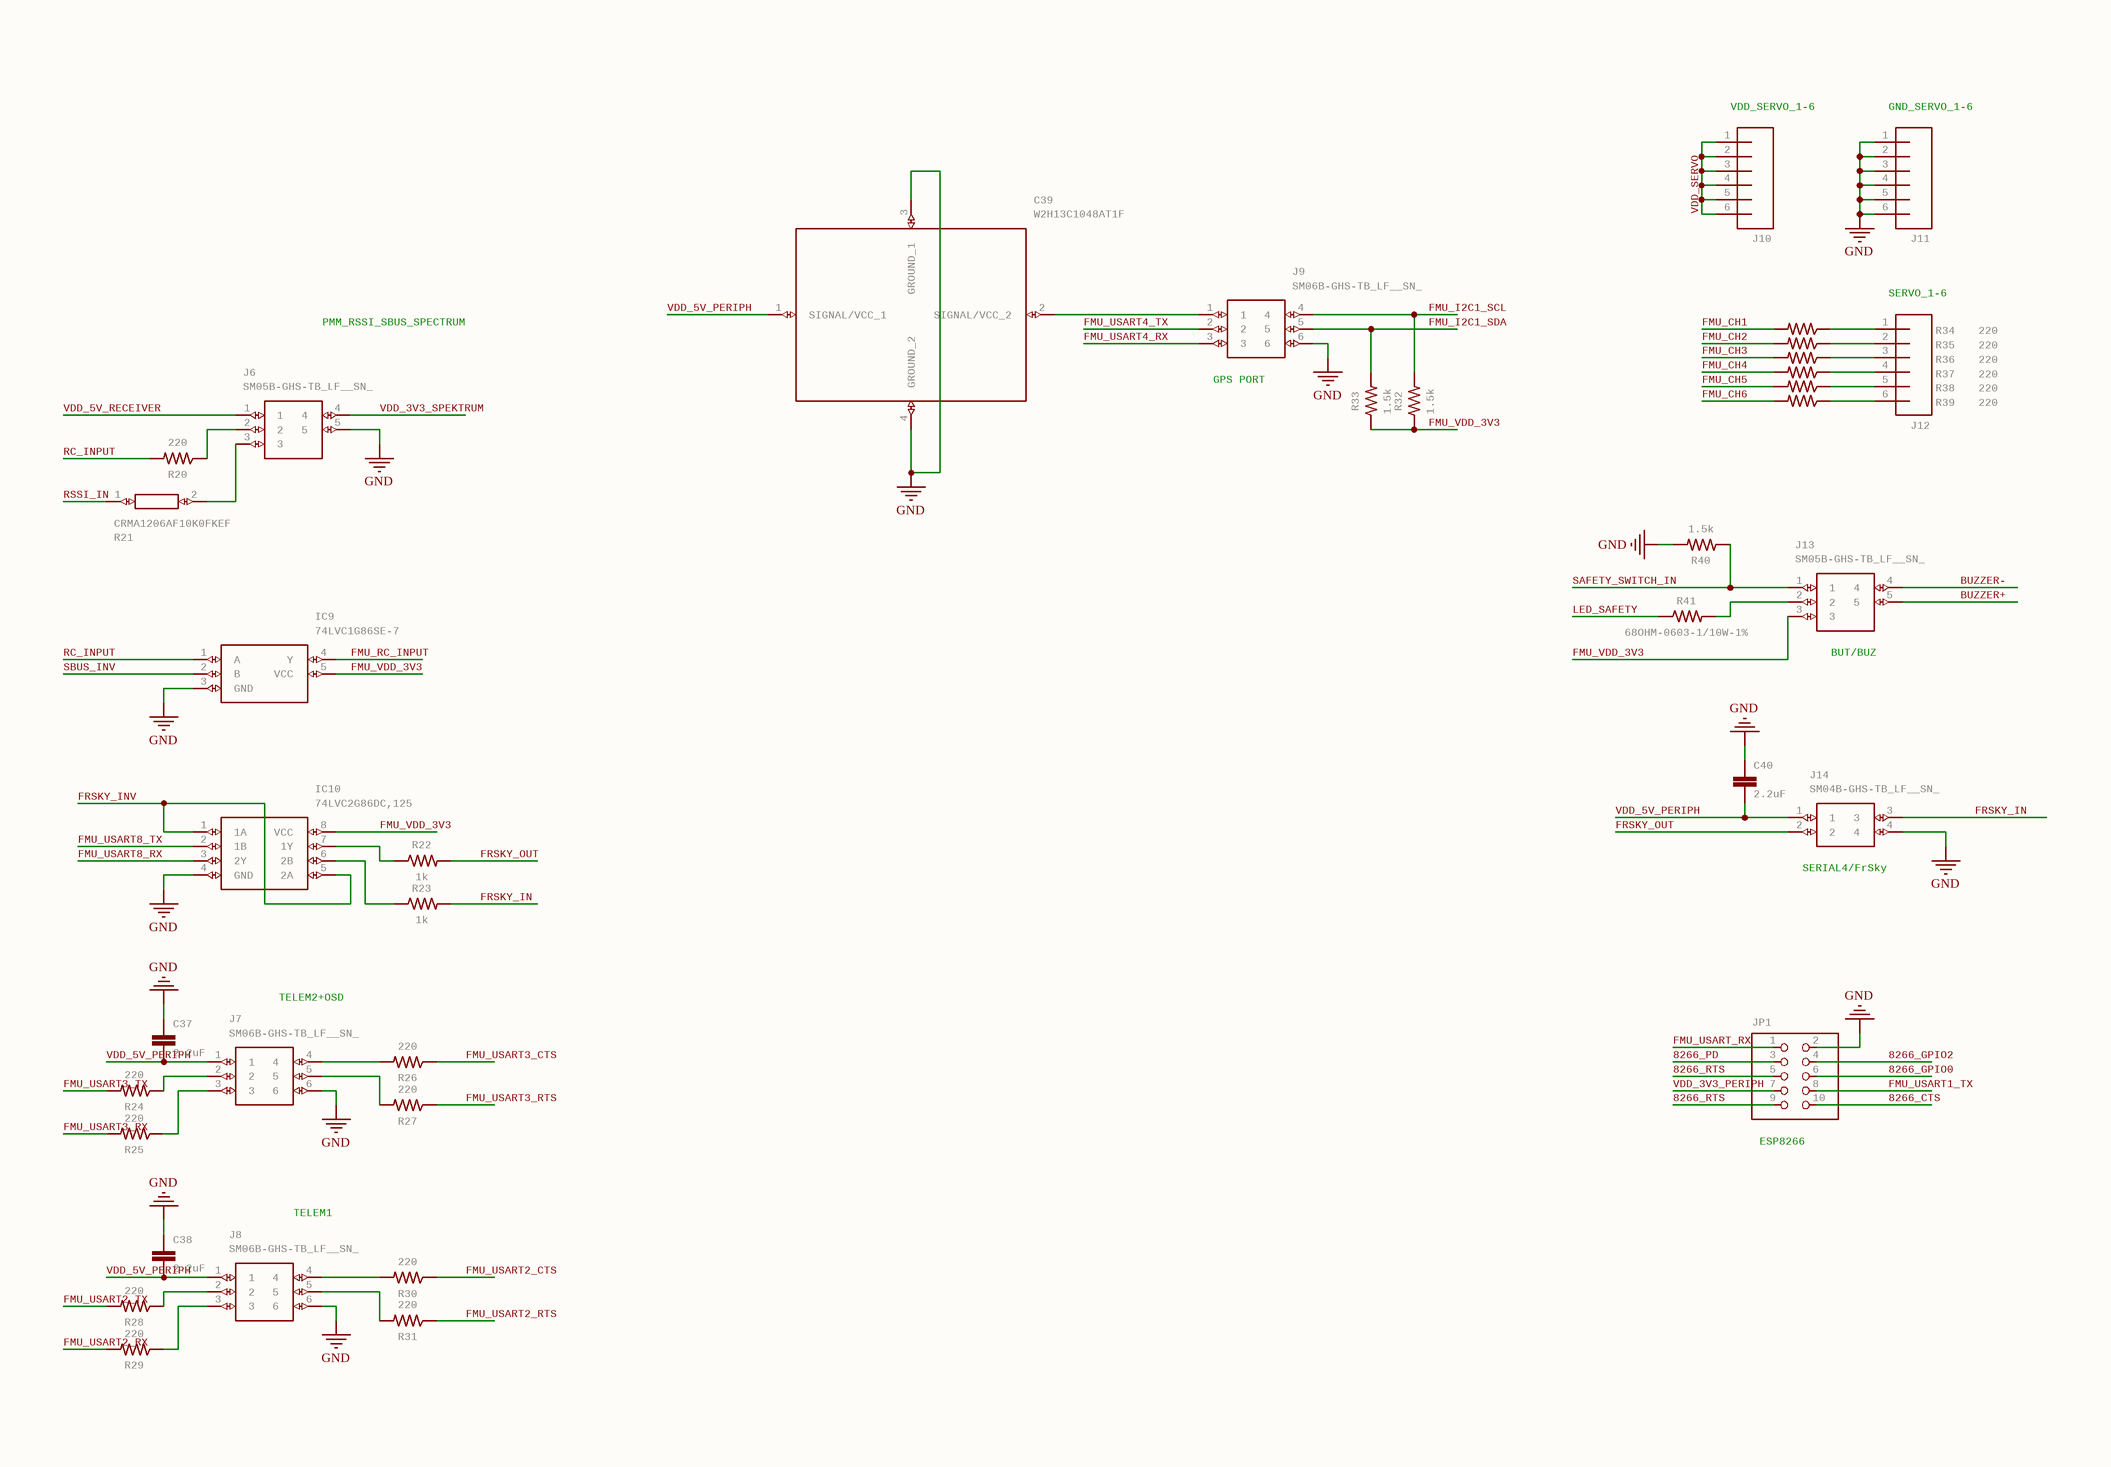
[diagram p4: Pixracer_V1_FMU_Alternative_3.SchDoc]

### Parts
C37  2.2uF  [1206]
C38  2.2uF  [1206]
C39  W2H13C1048AT1F  [W2H13C1048AT1A]
C40  2.2uF  [1206]
IC9  74LVC1G86SE-7  [SOT65P210X110-5N]
IC10  74LVC2G86DC,125  [SOP50P310X100-8N]
J6  SM05B-GHS-TB_LF__SN_  [SM05B-GHS-TB]
J7  SM06B-GHS-TB_LF__SN_  [SM06B-GHS-TB]
J8  SM06B-GHS-TB_LF__SN_  [SM06B-GHS-TB]
J9  SM06B-GHS-TB_LF__SN_  [SM06B-GHS-TB]
J10  CONN_06NO_SILK_NO_POP  [1X06_NO_SILK]  (value not drawn)
J11  CONN_06NO_SILK_NO_POP  [1X06_NO_SILK]  (value not drawn)
J12  CONN_06NO_SILK_NO_POP  [1X06_NO_SILK]  (value not drawn)
J13  SM05B-GHS-TB_LF__SN_  [SM05B-GHS-TB]
J14  SM04B-GHS-TB_LF__SN_  [SM04B-GHS-TB]
JP1  PINHD-2X5  [2X05]  (value not drawn)
R20  220  [0603]
R21  CRMA1206AF10K0FKEF  [RESC3216X74N]
R22  1k  [0603]
R23  1k  [0603]
R24  220  [0603]
R25  220  [0603]
R26  220  [0603]
R27  220  [0603]
R28  220  [0603]
R29  220  [0603]
R30  220  [0603]
R31  220  [0603]
R32  1.5k  [0603]
R33  1.5k  [0603]
R34  220  [0603]
R35  220  [0603]
R36  220  [0603]
R37  220  [0603]
R38  220  [0603]
R39  220  [0603]
R40  1.5k  [0603]
R41  68OHM-0603-1/10W-1%  [0603]

### Nets
GND: C37.1 C38.1 C39.3(GROUND_1) C39.4(GROUND_2) C40.1 IC9.3(GND) IC10.4(GND) J6.5 J7.6 J8.6 J9.6 J11.1 J11.2 J11.3 J11.4 J11.5 J11.6 J14.4 JP1.2 R40.2
8266_CTS: JP1.10
8266_GPIO0: JP1.6
8266_GPIO2: JP1.4
8266_PD: JP1.3
8266_RTS: JP1.5 JP1.9
BUZZER+: J13.5
BUZZER-: J13.4
FMU_CH1: R34.2
FMU_CH2: R35.2
FMU_CH3: R36.2
FMU_CH4: R37.2
FMU_CH5: R38.2
FMU_CH6: R39.2
FMU_I2C1_SCL: J9.4 R32.2
FMU_I2C1_SDA: J9.5 R33.2
FMU_RC_INPUT: IC9.4(Y)
FMU_USART1_TX: JP1.8
FMU_USART2_CTS: R30.1
FMU_USART2_RTS: R31.1
FMU_USART2_RX: R29.2
FMU_USART2_TX: R28.2
FMU_USART3_CTS: R26.1
FMU_USART3_RTS: R27.1
FMU_USART3_RX: R25.2
FMU_USART3_TX: R24.2
FMU_USART4_RX: J9.3
FMU_USART4_TX: J9.2
FMU_USART8_RX: IC10.3(2Y)
FMU_USART8_TX: IC10.2(1B)
FMU_USART_RX: JP1.1
FMU_VDD_3V3: IC9.5(VCC) IC10.8(VCC) J13.3 R32.1 R33.1
FRSKY_IN: J14.3 R23.2
FRSKY_INV: IC10.1(1A) IC10.5(2A)
FRSKY_OUT: J14.2 R22.2
LED_SAFETY: R41.1
RC_INPUT: IC9.1(A) R20.2
RSSI_IN: R21.1
SAFETY_SWITCH_IN: J13.1 R40.1
SBUS_INV: IC9.2(B)
VDD_3V3_PERIPH: JP1.7
VDD_3V3_SPEKTRUM: J6.4
VDD_5V_PERIPH: C37.2 C38.2 C39.1(SIGNAL/VCC_1) C40.2 J7.1 J8.1 J14.1
VDD_5V_RECEIVER: J6.1
VDD_SERVO: J10.1 J10.2 J10.3 J10.4 J10.5 J10.6
NetC39_2: C39.2(SIGNAL/VCC_2) J9.1
NetIC10_6: IC10.6(2B) R23.1
NetIC10_7: IC10.7(1Y) R22.1
NetJ6_2: J6.2 R20.1
NetJ6_3: J6.3 R21.2
NetJ7_2: J7.2 R24.1
NetJ7_3: J7.3 R25.1
NetJ7_4: J7.4 R26.2
NetJ7_5: J7.5 R27.2
NetJ8_2: J8.2 R28.1
NetJ8_3: J8.3 R29.1
NetJ8_4: J8.4 R30.2
NetJ8_5: J8.5 R31.2
NetJ12_1: J12.1 R34.1
NetJ12_2: J12.2 R35.1
NetJ12_3: J12.3 R36.1
NetJ12_4: J12.4 R37.1
NetJ12_5: J12.5 R38.1
NetJ12_6: J12.6 R39.1
NetJ13_2: J13.2 R41.2

### Notes on the sheet
- (near J10) VDD_SERVO_1-6
- (near J11) GND_SERVO_1-6
- PMM_RSSI_SBUS_SPECTRUM
- (near J12) SERVO_1-6
- (near J9) GPS PORT
- (near J13) BUT/BUZ
- (near J14) SERIAL4/FrSky
- TELEM2+OSD
- (near JP1) ESP8266
- TELEM1

### Library data of the parts
C37 C38 C40 = 2.2UF-1206-50V-10%: as C1 on sheet Pixracer_V1_FMU_Alternative_0; DeviceName: -1206-50V-10%; LibraryName: SparkFun-Capacitors; DeviceSetName: 2.2UF
C39 = W2H13C1048AT1F: as C26 on sheet Pixracer_V1_FMU_Alternative_1; SymbolName_1: W2H13C1048AT1F; LibraryName: SamacSys_Parts; DeviceSetName: W2H13C1048AT1F; DESCRIPTION: Feed Through Capacitors 25volt 0.1uF X7R; HEIGHT: 1mm; MANUFACTURER_PART_NUMBER: W2H13C1048AT1F; MOUSER_PART_NUMBER: 581-W2H13C1048AT1F; MOUSER_PRICE-STOCK: https://www.mouser.com/Search/Refine.aspx?Keyword=581-W2H13C1048AT1F
IC9 = 74LVC1G86SE-7: DiodesZetex 74LVC1G86SE-7, XOR 2 Input XOR, 1.65  5.5 V, 5-Pin SOT-353   Source:  Datasheet; MANUFACTURER_NAME: Diodes Inc.; GateName_1: G$1; SymbolName_1: 74LVC1G86SE-7; LibraryName: SamacSys_Parts; DeviceSetName: 74LVC1G86SE-7; DESCRIPTION: DiodesZetex 74LVC1G86SE-7, XOR 2 Input XOR, 1.65  5.5 V, 5-Pin SOT-353; HEIGHT: 1.1mm; MANUFACTURER_PART_NUMBER: 74LVC1G86SE-7; MOUSER_PART_NUMBER: 621-74LVC1G86SE-7; MOUSER_PRICE-STOCK: https://www.mouser.co.uk/ProductDetail/Diodes-Incorporated/74LVC1G86SE-7/?qs=8Dv1RiiPiVJ%252BnYSWg3kTgg%3D%3D
IC10 = 74LVC2G86DC,125: 74LVC2G86 - Dual 2-input EXCLUSIVE-OR gate@en-us   Source:  Datasheet; MANUFACTURER_NAME: Nexperia; GateName_1: G$1; SymbolName_1: 74LVC2G86DC,125; LibraryName: SamacSys_Parts; DeviceSetName: 74LVC2G86DC,125; DESCRIPTION: 74LVC2G86 - Dual 2-input EXCLUSIVE-OR gate; HEIGHT: 1mm; MANUFACTURER_PART_NUMBER: 74LVC2G86DC,125; MOUSER_PART_NUMBER: 771-LVC2G86DC125; MOUSER_PRICE-STOCK: https://www.mouser.co.uk/ProductDetail/Nexperia/74LVC2G86DC125?qs=me8TqzrmIYXbZy3sMRjHUw%3D%3D
J6 J13 = SM05B-GHS-TB_LF__SN_: JST GH Series, 1.25mm Pitch 5 Way Right Angle PCB Header, Solder Termination, 1A   Source:  Datasheet; MANUFACTURER_NAME: JST (JAPAN SOLDERLESS TERMINALS); MANUFACTURER_PART_NUMBER: SM05B-GHS-TB(LF)(SN); GateName_1: G$1; SymbolName_1: SM05B-GHS-TB_LF__SN_; LibraryName: SamacSys_Parts; DeviceSetName: SM05B-GHS-TB_LF__SN_; DESCRIPTION: JST GH Series, 1.25mm Pitch 5 Way Right Angle PCB Header, Solder Termination, 1A; HEIGHT: mm; RS_PART_NUMBER: 7521807P; RS_PRICE-STOCK: http://uk.rs-online.com/web/p/products/7521807P
J7-J9 = SM06B-GHS-TB_LF__SN_: as J3 on sheet Pixracer_V1_FMU_Alternative_2; SymbolName_1: SM06B-GHS-TB_LF__SN_; LibraryName: SamacSys_Parts; DeviceSetName: SM06B-GHS-TB_LF__SN_; DESCRIPTION: GH 1.25mm header side entry 6 way JST GH Series, 1.25mm Pitch 6 Way Right Angle PCB Header, Solder Termination, 1A; HEIGHT: mm; RS_PART_NUMBER: 7521800P; RS_PRICE-STOCK: http://uk.rs-online.com/web/p/products/7521800P
J10-J12 = CONN_06NO_SILK_NO_POP: Multi connection point. Often used as Generic Header-pin footprint for 0.1 inch spaced/style header connections    On any of the 0.1 inch spaced packages, you can populate with these:  Break Away Headers - Straight (PRT-00116)   Break Away Male Headers - Right Angle (PRT-00553)   Female Headers (PRT-00115)   Break Away Headers - Machine Pin (PRT-00117)   Break Away Female Headers - Swiss Machine Pin (PRT-00743)   Arduino Stackable Header - 6 Pin (PRT-09280)        For SCREWTERMINALS and SPRING TERMINALS visit here:  Screw Terimnals on SparkFun.com (5mm/3.5mm/2.54mm spacing)       This device is also useful as a general connection point to wire up your design to another part of your project. Our various solder wires solder well into these plated through hole pads.  Hook-Up Wire - Assortment (Stranded, 22 AWG) (PRT-11375)   Hook-Up Wire - Assortment (Solid Core, 22 AWG) (PRT-11367)   View the entire wire category on our website here; GateName_1: G$1; SymbolName_1: CONN_06; DeviceName: NO_SILK_NO_POP; LibraryName: SparkFun-Connectors; DeviceSetName: CONN_06
J14 = SM04B-GHS-TB_LF__SN_: as J5 on sheet Pixracer_V1_FMU_Alternative_2; SymbolName_1: SM04B-GHS-TB_LF__SN_; LibraryName: SamacSys_Parts; DeviceSetName: SM04B-GHS-TB_LF__SN_; DESCRIPTION: JST GH Series, 1.25mm Pitch 4 Way Right Angle PCB Header, Solder Termination, 1A; HEIGHT: mm; RS_PART_NUMBER: 7521797P; RS_PRICE-STOCK: http://uk.rs-online.com/web/p/products/7521797P
JP1 = PINHD-2X5: PIN HEADER; GateName_1: A; SymbolName_1: PINH2X5; POPULARITY: 35; LibraryName: pinhead; DeviceSetName: PINHD-2X5
R20 R24-R31 R34-R39 = 220OHM-0603-1/10W-1%: as R3 on sheet Pixracer_V1_FMU_Alternative_0; SymbolName_1: RESISTOR; DeviceName: -0603-1/10W-1%; LibraryName: SparkFun-Resistors
R21 = CRMA1206AF10K0FKEF: as R1 on sheet Pixracer_V1_FMU_Alternative_0; SymbolName_1: CRMA1206AF10K0FKEF; LibraryName: SamacSys_Parts; DeviceSetName: CRMA1206AF10K0FKEF; DESCRIPTION: Thick Film Resistors - SMD 0.30W 10Kohm 1% AEC-Q200; HEIGHT: 0.74mm; MANUFACTURER_PART_NUMBER: CRMA1206AF10K0FKEF; MOUSER_PART_NUMBER: 71-CRMA1206AF10K0FKF; MOUSER_PRICE-STOCK: https://www.mouser.co.uk/ProductDetail/Vishay/CRMA1206AF10K0FKEF?qs=TiOZkKH1s2Q81nOs5FD1Wg%3D%3D
R22 R23 = 1KOHM-0603-1/10W-1%: as R4 on sheet Pixracer_V1_FMU_Alternative_0; SymbolName_1: RESISTOR; DeviceName: -0603-1/10W-1%; LibraryName: SparkFun-Resistors
R32 R33 R40 = 1.5KOHM-0603-1/10W-1%: 1.5kÎ© resistor    A resistor is a passive two-terminal electrical component that implements electrical resistance as a circuit element. Resistors act to reduce current flow, and, at the same time, act to lower voltage levels within circuits. - Wikipedia; GateName_1: G$1; PROD_ID: RES-08306; SymbolName_1: RESISTOR; DeviceName: -0603-1/10W-1%; LibraryName: SparkFun-Resistors; DeviceSetName: 1.5KOHM
R41 = 68OHM-0603-1/10W-1%: 68Î© resistor    A resistor is a passive two-terminal electrical component that implements electrical resistance as a circuit element. Resistors act to reduce current flow, and, at the same time, act to lower voltage levels within circuits. - Wikipedia; GateName_1: G$1; DeviceSetName: 68OHM; SymbolName_1: RESISTOR; DeviceName: -0603-1/10W-1%; LibraryName: SparkFun-Resistors

## Sheet Pixracer_V1_FMU_Alternative_4.SchDoc
size 335 x 216 mm; Origin: Eagle
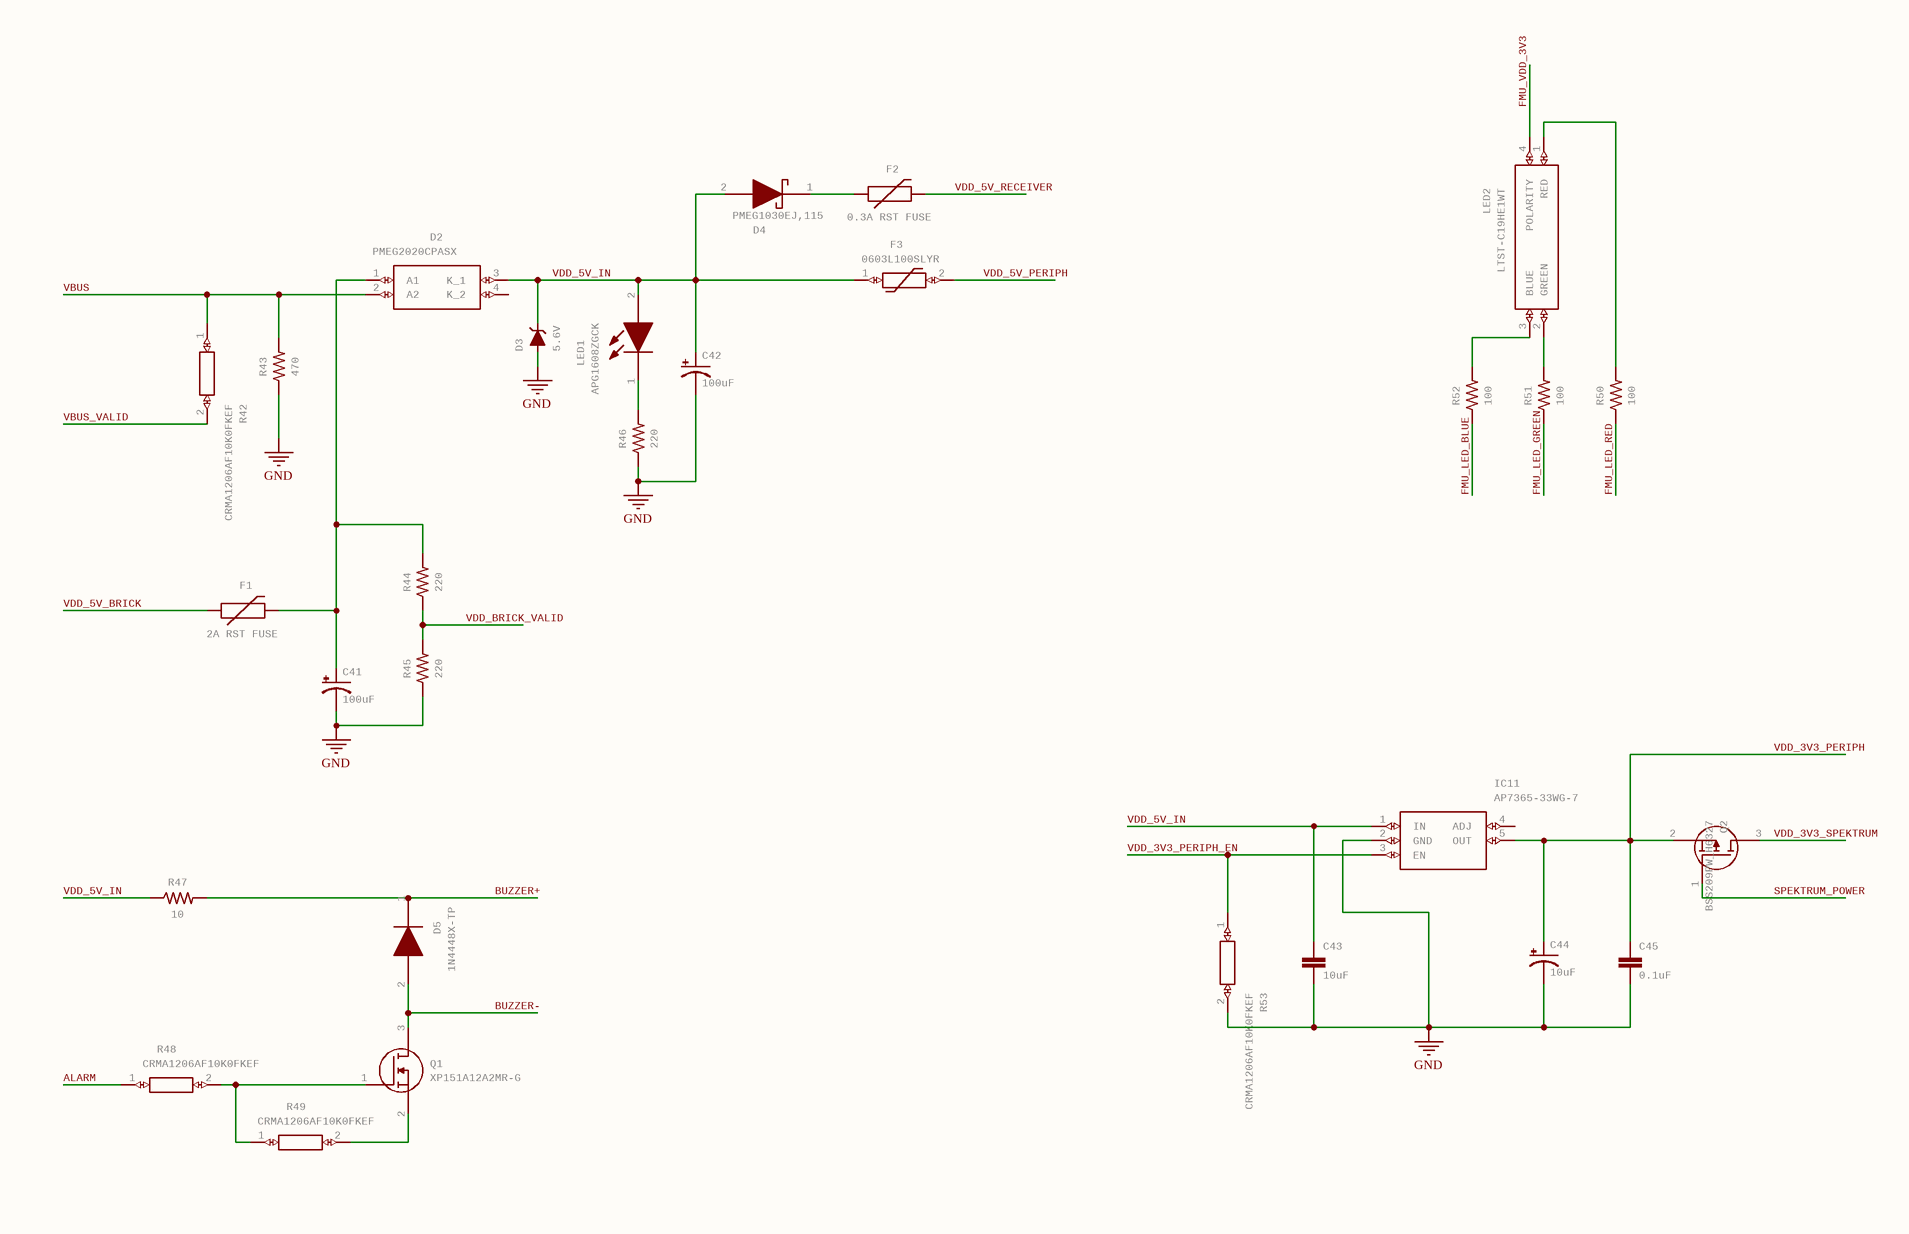
[diagram p5: Pixracer_V1_FMU_Alternative_4.SchDoc]

### Parts
C41  100uF  [1206-POLAR]
C42  100uF  [1206-POLAR]
C43  10uF  [1206]
C44  10uF  [0603-POLAR]
C45  0.1uF  [0603]
D2  PMEG2020CPASX  [PMEG2020CPASX]
D3  5.6V  [SOT23-3]
D4  PMEG1030EJ,115  [SODFL2512X80N]
D5  1N4448X-TP  [1N4448XTP]
F1  2A RST FUSE  [1206]
F2  0.3A RST FUSE  [0805]
F3  0603L100SLYR  [0603L050SLYR]
IC11  AP7365-33WG-7  [SOT95P285X130-5N]
LED1  APG1608ZGCK  [LEDC1608X28N]
LED2  LTST-C19HE1WT  [LTST-C19HE1WT]
Q1  XP151A12A2MR-G  [SOT95P280X130-3N]
Q2  BSS209PW_H6327  [SOT65P210X100-3N]
R42  CRMA1206AF10K0FKEF  [RESC3216X74N]
R43  470  [0603]
R44  220  [0603]
R45  220  [0603]
R46  220  [0603]
R47  10  [0603]
R48  CRMA1206AF10K0FKEF  [RESC3216X74N]
R49  CRMA1206AF10K0FKEF  [RESC3216X74N]
R50  100  [0603]
R51  100  [0603]
R52  100  [0603]
R53  CRMA1206AF10K0FKEF  [RESC3216X74N]

### Nets
GND: C41.2(-) C42.2(-) C43.2 C44.- C45.2 D3.1(A) IC11.2(GND) R43.1 R45.1 R46.1 R53.2
ALARM: R48.1
BUZZER+: D5.1(K) R47.2
BUZZER-: D5.2(A) Q1.3(D)
FMU_LED_BLUE: R52.1
FMU_LED_GREEN: R51.1
FMU_LED_RED: R50.1
FMU_VDD_3V3: LED2.4(POLARITY)
SPEKTRUM_POWER: Q2.1(G)
VBUS: D2.2(A2) R42.1 R43.2
VBUS_VALID: R42.2
VDD_3V3_PERIPH: C44.+ C45.1 IC11.5(OUT) Q2.2(S)
VDD_3V3_PERIPH_EN: IC11.3(EN) R53.1
VDD_3V3_SPEKTRUM: Q2.3(D)
VDD_5V_BRICK: F1.1
VDD_5V_IN: C42.1(+) C43.1 D2.3(K_1) D3.3(C) D4.2(A) F3.1 IC11.1(IN) LED1.2(A) R47.1
VDD_5V_PERIPH: F3.2
VDD_5V_RECEIVER: F2.2
VDD_BRICK_VALID: R44.1 R45.2
NetC41_1: C41.1(+) D2.1(A1) F1.2 R44.2
NetD4_1: D4.1(K) F2.1
NetLED1_1: LED1.1(K) R46.2
NetLED2_1: LED2.1(RED) R50.2
NetLED2_2: LED2.2(GREEN) R51.2
NetLED2_3: LED2.3(BLUE) R52.2
NetQ1_1: Q1.1(G) R48.2 R49.1
NetQ1_2: Q1.2(S) R49.2

Not connected (* = marked no-connect by the designer): D2 4(K_2); IC11 4(ADJ)

### Library data of the parts
C41 C42 = 100UF-POLAR-1206-6.3V-20%(TANT): 100ÂµF polarized capacitors    A capacitor is a passive two-terminal electrical component used to store electrical energy temporarily in an electric field.; GateName_1: G$1; SymbolName_1: CAP_POL; PROD_ID: CAP-14093; DeviceName: -1206-6.3V-20%(TANT); LibraryName: SparkFun-Capacitors; DeviceSetName: 100UF-POLAR
C43 = 10UF-1206-6.3V-20%: as C15 on sheet Pixracer_V1_FMU_Alternative_0; DeviceName: -1206-6.3V-20%; LibraryName: SparkFun-Capacitors; DeviceSetName: 10UF
C44 = 10UF-POLAR-0603-6.3V-20%(TANT): 10.0ÂµF polarized capacitors    A capacitor is a passive two-terminal electrical component used to store electrical energy temporarily in an electric field.; GateName_1: G$1; SymbolName_1: CAP_POL; PROD_ID: CAP-13210; DeviceName: -0603-6.3V-20%(TANT); LibraryName: SparkFun-Capacitors; DeviceSetName: 10UF-POLAR
C45 = 0.1UF-0603-100V-10%-X7R-WE: as C2 on sheet Pixracer_V1_FMU_Alternative_0; DeviceName: -0603-100V-10%-X7R-WE; LibraryName: SparkFun-Capacitors; DeviceSetName: 0.1UF
D2 = PMEG2020CPASX: Schottky Diodes & Rectifiers 20V 2A dual MEGA Schottky   Source:  Datasheet; MANUFACTURER_NAME: Nexperia; GateName_1: G$1; SymbolName_1: PMEG2020CPASX; LibraryName: SamacSys_Parts; DeviceSetName: PMEG2020CPASX; DESCRIPTION: Schottky Diodes & Rectifiers 20V 2A dual MEGA Schottky; HEIGHT: 0.65mm; MANUFACTURER_PART_NUMBER: PMEG2020CPASX; MOUSER_PART_NUMBER: 771-PMEG2020CPASX; MOUSER_PRICE-STOCK: https://www.mouser.co.uk/ProductDetail/Nexperia/PMEG2020CPASX?qs=K2OaAKmNuLimeK0EUCzHKQ%3D%3D
D3 = DIODE-ZENER-MMBZ5233BLT1G: Zener Diode    A Zener diode allows current to flow from its anode to its cathode like a normal semiconductor diode, but it also permits current to flow in the reverse direction when its "Zener voltage" is reached. - WIkipedia; GateName_1: G$1; PROD_ID: DIO-14123; SymbolName_1: DIODE-ZENER; DeviceName: -MMBZ5233BLT1G; LibraryName: SparkFun-DiscreteSemi; DeviceSetName: DIODE-ZENER
D4 = PMEG1030EJ,115: Schottky Diodes & Rectifiers SCHOTTKY 10V 3A   Source:  Datasheet; MANUFACTURER_NAME: Nexperia; GateName_1: G$1; SymbolName_1: PMEG1030EJ,115; LibraryName: SamacSys_Parts; DeviceSetName: PMEG1030EJ,115; DESCRIPTION: Schottky Diodes & Rectifiers SCHOTTKY 10V 3A; HEIGHT: 0.8mm; MANUFACTURER_PART_NUMBER: PMEG1030EJ,115; MOUSER_PART_NUMBER: 771-PMEG1030EJ-T/R; MOUSER_PRICE-STOCK: https://www.mouser.co.uk/ProductDetail/Nexperia/PMEG1030EJ115?qs=LOCUfHb8d9vmk7P%2FuYbs5A%3D%3D
D5 = 1N4448X-TP: Diodes - General Purpose, Power, Switching 250mA 75V 500mA 250mA 150mW 75Vbr   Source:  Datasheet; MANUFACTURER_NAME: Micro Commercial Components (MCC); GateName_1: G$1; SymbolName_1: 1N4448X-TP; LibraryName: SamacSys_Parts; DeviceSetName: 1N4448X-TP; DESCRIPTION: Diodes - General Purpose, Power, Switching 250mA 75V 500mA 250mA 150mW 75Vbr; HEIGHT: 0.65mm; MANUFACTURER_PART_NUMBER: 1N4448X-TP; MOUSER_PART_NUMBER: 833-1N4448X-TP; MOUSER_PRICE-STOCK: https://www.mouser.com/Search/Refine.aspx?Keyword=833-1N4448X-TP
F1 = PPTC_6V500MA-2: Resettable Fuse PPTC    Resettable Fuse. Really a sort of resistor with a polymeric positive temperature coefficient whose resistance increases dramatically with an increase in temperature. When heated by the power passing through the resistance rises causing the current to be limited, protecting the circuit. This is achieved by the transition of the polymer from a crystalline to an amorphous state where the conductive carbon separates breaking the conductive pathways found in the cool crystalline structure. When a PPTC cools back down it resumes conducting letting the circuit turn back on.   SparkFun Products:  SparkFun RedBoard - Programmed with Arduino  Pro Micro - 5V/16MHz  Arduino Pro 328 - 5V/16MHz  MP3 Trigger; GateName_1: F1; PROD_ID: RES-08585; SymbolName_1: PPTC; DeviceName: _6V500MA-2; LibraryName: SparkFun-Fuses; DeviceSetName: PPTC
F2 = PPTC_6V500MA: Resettable Fuse PPTC    Resettable Fuse. Really a sort of resistor with a polymeric positive temperature coefficient whose resistance increases dramatically with an increase in temperature. When heated by the power passing through the resistance rises causing the current to be limited, protecting the circuit. This is achieved by the transition of the polymer from a crystalline to an amorphous state where the conductive carbon separates breaking the conductive pathways found in the cool crystalline structure. When a PPTC cools back down it resumes conducting letting the circuit turn back on.   SparkFun Products:  SparkFun RedBoard - Programmed with Arduino  Pro Micro - 5V/16MHz  Arduino Pro 328 - 5V/16MHz  MP3 Trigger; GateName_1: F1; PROD_ID: RES-13945; SymbolName_1: PPTC; DeviceName: _6V500MA; LibraryName: SparkFun-Fuses; DeviceSetName: PPTC
F3 = 0603L100SLYR: PTC 6V POLYFUSE SURF MOUNT 0603 SL 1.00A   Source:  Datasheet; MANUFACTURER_NAME: LITTELFUSE; GateName_1: G$1; SymbolName_1: 0603L100SLYR; LibraryName: SamacSys_Parts; DeviceSetName: 0603L100SLYR; DESCRIPTION: PTC 6V POLYFUSE SURF MOUNT 0603 SL 1.00A; HEIGHT: 0.75mm; MANUFACTURER_PART_NUMBER: 0603L100SLYR; MOUSER_PART_NUMBER: 576-0603L100SLYR; MOUSER_PRICE-STOCK: https://www.mouser.co.uk/ProductDetail/Littelfuse/0603L100SLYR?qs=%252BPPFKVzHyAKqCAJtLoK6vw%3D%3D
IC11 = AP7365-33WG-7: DiodesZetex AP7365-33WG-7, LDO Voltage Regulator, 600mA, 3.3 V +/-2%, 2  6 Vin, 5-Pin SOT-25   Source:  Datasheet; MANUFACTURER_NAME: Diodes Inc.; GateName_1: G$1; SymbolName_1: AP7365-33WG-7; LibraryName: SamacSys_Parts; DeviceSetName: AP7365-33WG-7; DESCRIPTION: DiodesZetex AP7365-33WG-7, LDO Voltage Regulator, 600mA, 3.3 V +/-2%, 2  6 Vin, 5-Pin SOT-25; HEIGHT: 1.3mm; MANUFACTURER_PART_NUMBER: AP7365-33WG-7; MOUSER_PART_NUMBER: 621-AP7365-33WG-7; MOUSER_PRICE-STOCK: https://www.mouser.co.uk/ProductDetail/Diodes-Incorporated/AP7365-33WG-7?qs=abZ1nkZpTuOZFvxvoFPL0w%3D%3D
LED1 = APG1608ZGCK: Standard LEDs - SMD 1.6X0.8MM   Source:  Datasheet; MANUFACTURER_NAME: Kingbright; GateName_1: G$1; SymbolName_1: APG1608ZGCK; LibraryName: SamacSys_Parts; DeviceSetName: APG1608ZGCK; DESCRIPTION: Standard LEDs - SMD 1.6X0.8MM; HEIGHT: 0.28mm; MANUFACTURER_PART_NUMBER: APG1608ZGCK; MOUSER_PART_NUMBER: 604-APG1608ZGCK; MOUSER_PRICE-STOCK: https://www.mouser.co.uk/ProductDetail/Kingbright/APG1608ZGCK?qs=Oo40KB9lBTmmOma0ledTcg%3D%3D
LED2 = LTST-C19HE1WT: LED,SMD,1.6x1.5x0.4mm,Red/Green/Blue Lite-On LTST-C19HE1WT 3 RGB LED, 470 / 525 / 624 nm 3-Pin, Rectangle Lens SMD package   Source:  Datasheet; GateName_1: G$1; SymbolName_1: LTST-C19HE1WT; LibraryName: SamacSys_Parts; DeviceSetName: LTST-C19HE1WT; DESCRIPTION: LED,SMD,1.6x1.5x0.4mm,Red/Green/Blue Lite-On LTST-C19HE1WT 3 RGB LED, 470 / 525 / 624 nm 3-Pin, Rectangle Lens SMD package; HEIGHT: mm; MANUFACTURER_NAME: Lite-On; MANUFACTURER_PART_NUMBER: LTST-C19HE1WT; MOUSER_PART_NUMBER: 859-LTST-C19HE1WT; MOUSER_PRICE-STOCK: https://www.mouser.co.uk/ProductDetail/Lite-On/LTST-C19HE1WT?qs=WAWaI72GHKxJLPArJA9%252BUw%3D%3D
Q1 = XP151A12A2MR-G: Power MOSFET   Source:  Datasheet; MANUFACTURER_NAME: Torex; GateName_1: G$1; SymbolName_1: XP151A12A2MR-G; LibraryName: SamacSys_Parts; DeviceSetName: XP151A12A2MR-G; DESCRIPTION: Power MOSFET; HEIGHT: 1.3mm; MANUFACTURER_PART_NUMBER: XP151A12A2MR-G; MOUSER_PART_NUMBER: 865-XP151A12A2MR-G; MOUSER_PRICE-STOCK: https://www.mouser.co.uk/ProductDetail/Torex-Semiconductor/XP151A12A2MR-G?qs=AsjdqWjXhJ%252BYt8dSaKx3TA%3D%3D
Q2 = BSS209PW_H6327: MOSFET P-Ch -20V -630mA SOT-323-3   Source:  Datasheet; MANUFACTURER_NAME: Infineon; MANUFACTURER_PART_NUMBER: BSS209PW H6327; GateName_1: G$1; SymbolName_1: BSS209PW_H6327; LibraryName: SamacSys_Parts; DeviceSetName: BSS209PW_H6327; DESCRIPTION: MOSFET P-Ch -20V -630mA SOT-323-3; HEIGHT: 1mm; MOUSER_PART_NUMBER: 726-BSS209PWH6327; MOUSER_PRICE-STOCK: https://www.mouser.com/Search/Refine.aspx?Keyword=726-BSS209PWH6327
R42 R48 R49 R53 = CRMA1206AF10K0FKEF: as R1 on sheet Pixracer_V1_FMU_Alternative_0; SymbolName_1: CRMA1206AF10K0FKEF; LibraryName: SamacSys_Parts; DeviceSetName: CRMA1206AF10K0FKEF; DESCRIPTION: Thick Film Resistors - SMD 0.30W 10Kohm 1% AEC-Q200; HEIGHT: 0.74mm; MANUFACTURER_PART_NUMBER: CRMA1206AF10K0FKEF; MOUSER_PART_NUMBER: 71-CRMA1206AF10K0FKF; MOUSER_PRICE-STOCK: https://www.mouser.co.uk/ProductDetail/Vishay/CRMA1206AF10K0FKEF?qs=TiOZkKH1s2Q81nOs5FD1Wg%3D%3D
R43 = 470OHM-0603-1/10W-1%: 470Î© resistor    A resistor is a passive two-terminal electrical component that implements electrical resistance as a circuit element. Resistors act to reduce current flow, and, at the same time, act to lower voltage levels within circuits. - Wikipedia; GateName_1: G$1; DeviceSetName: 470OHM; PROD_ID: RES-07869; SymbolName_1: RESISTOR; DeviceName: -0603-1/10W-1%; LibraryName: SparkFun-Resistors
R44-R46 = 220OHM-0603-1/10W-1%: as R3 on sheet Pixracer_V1_FMU_Alternative_0; SymbolName_1: RESISTOR; DeviceName: -0603-1/10W-1%; LibraryName: SparkFun-Resistors
R47 = 10OHM-0603-1/10W-5%: 10Î© resistor    A resistor is a passive two-terminal electrical component that implements electrical resistance as a circuit element. Resistors act to reduce current flow, and, at the same time, act to lower voltage levels within circuits. - Wikipedia; GateName_1: G$1; DeviceSetName: 10OHM; PROD_ID: RES-09834; SymbolName_1: RESISTOR; DeviceName: -0603-1/10W-5%; LibraryName: SparkFun-Resistors
R50-R52 = 100OHM-0603-1/10W-1%: 100Î© resistor    A resistor is a passive two-terminal electrical component that implements electrical resistance as a circuit element. Resistors act to reduce current flow, and, at the same time, act to lower voltage levels within circuits. - Wikipedia; GateName_1: G$1; DeviceSetName: 100OHM; PROD_ID: RES-07863; SymbolName_1: RESISTOR; DeviceName: -0603-1/10W-1%; LibraryName: SparkFun-Resistors